# EAGLE board marionette (EAGLE 7.7.0), part 1 of 3
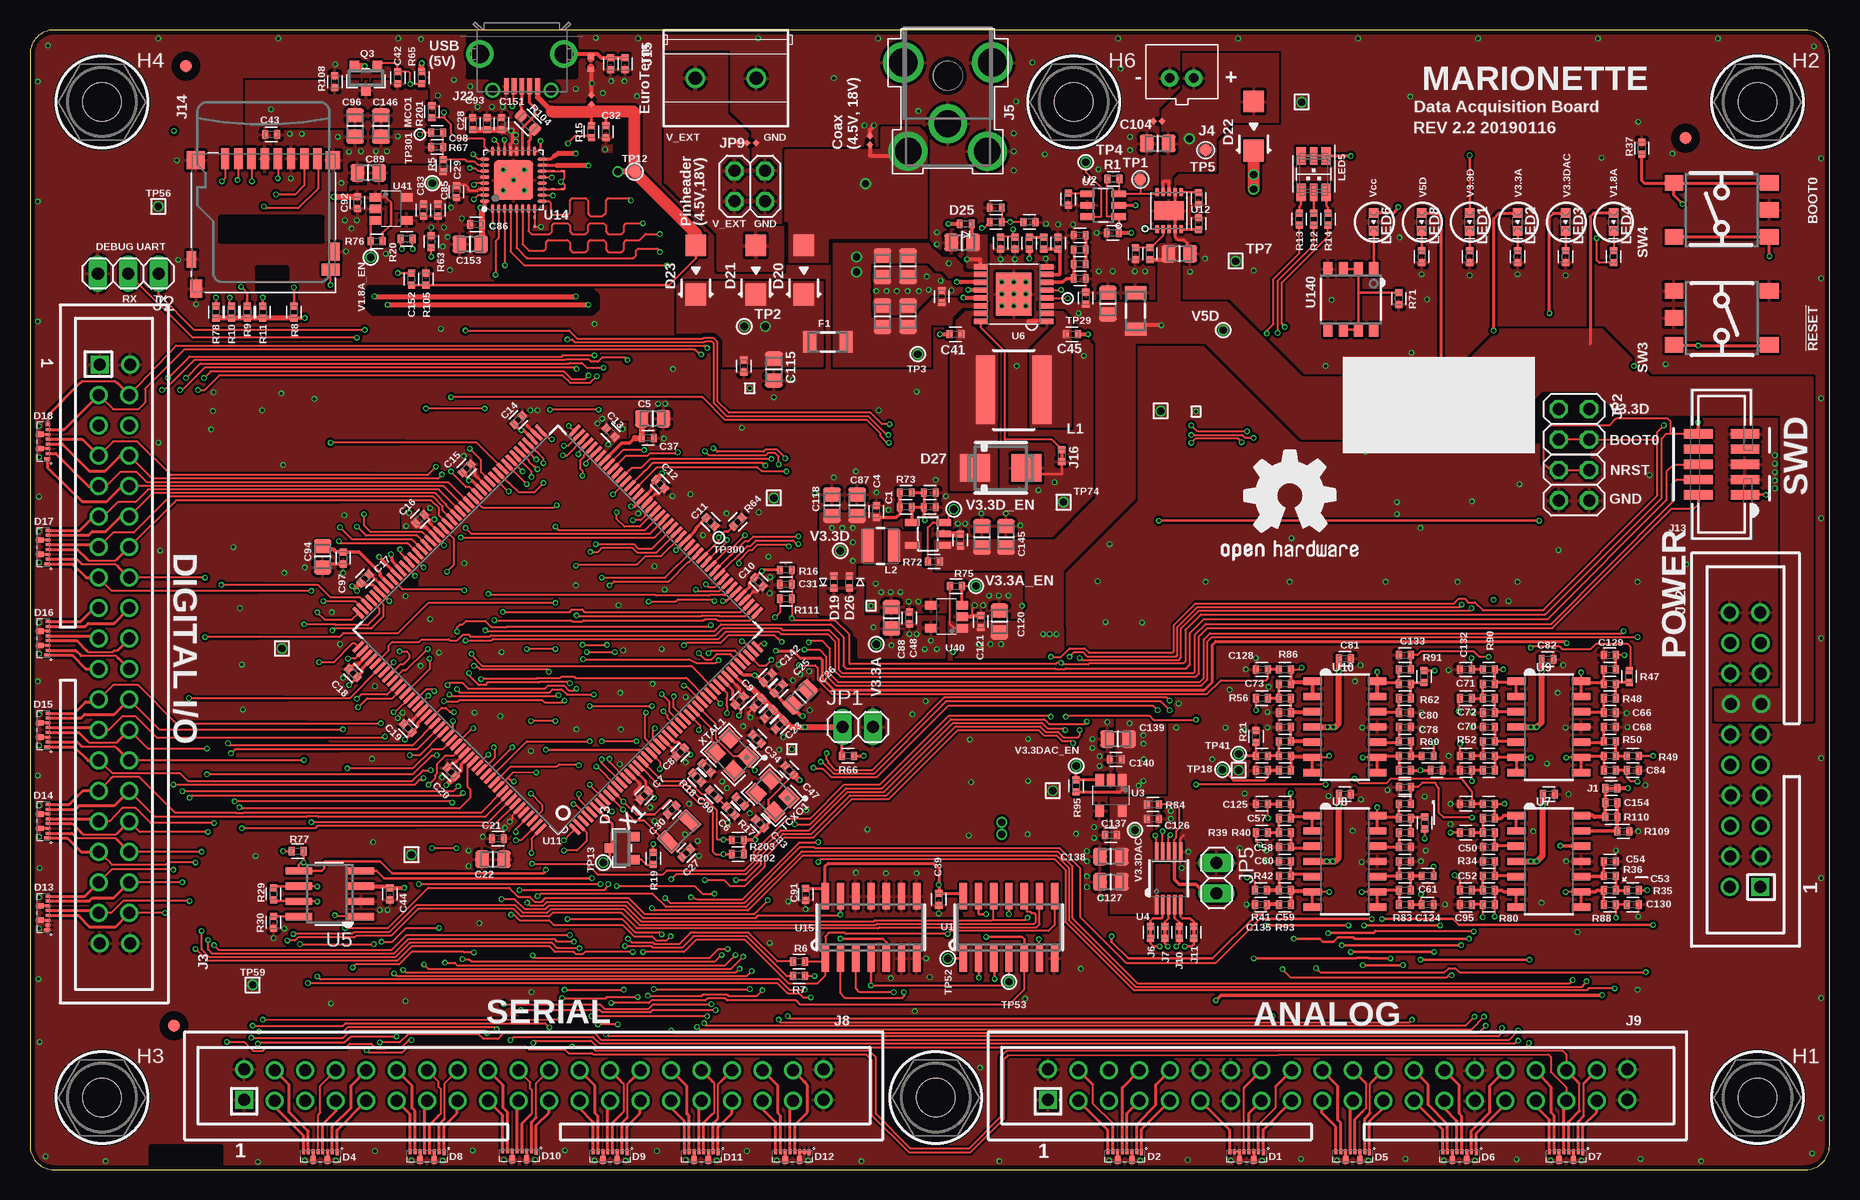
[diagram p11: board, top side]
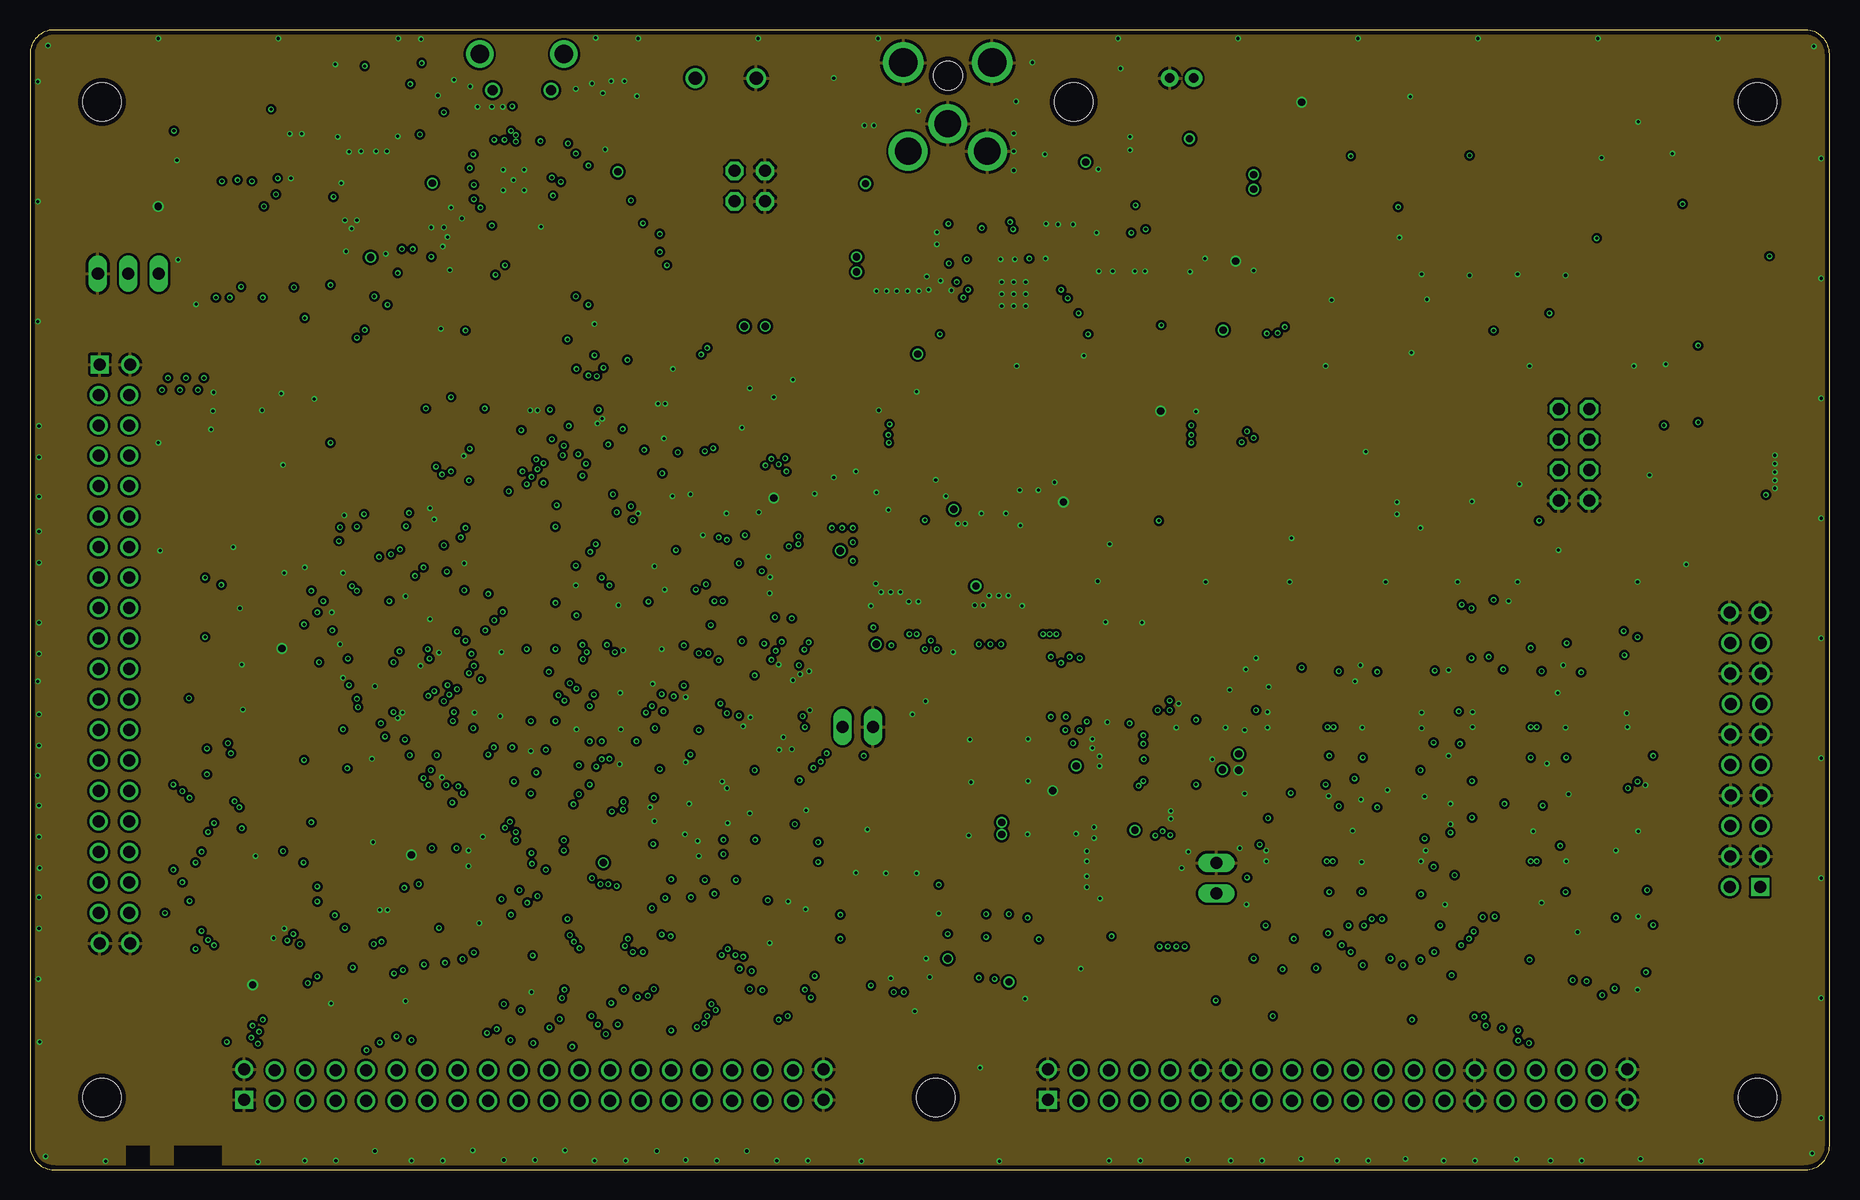
[diagram p12: board, inner layer Route2]
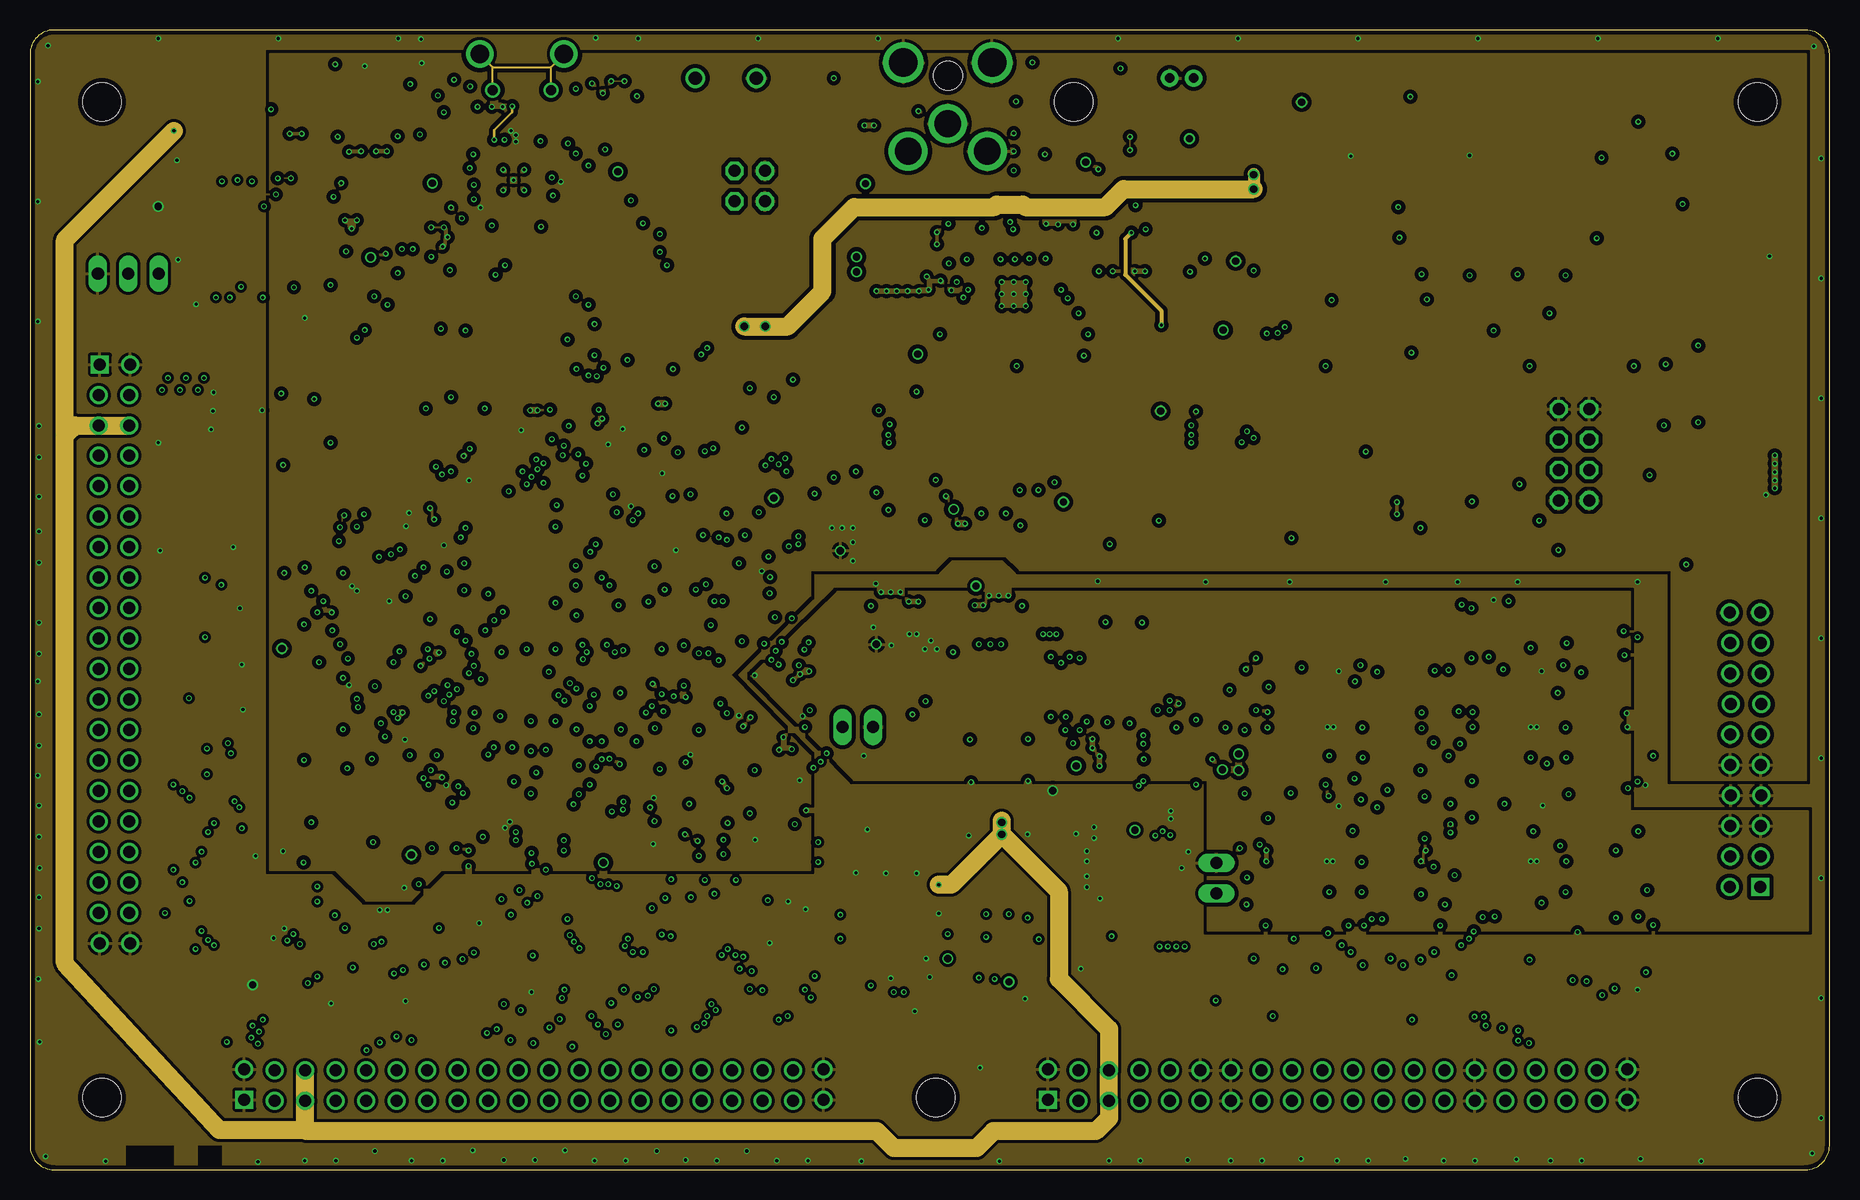
[diagram p13: board, inner layer Route15]
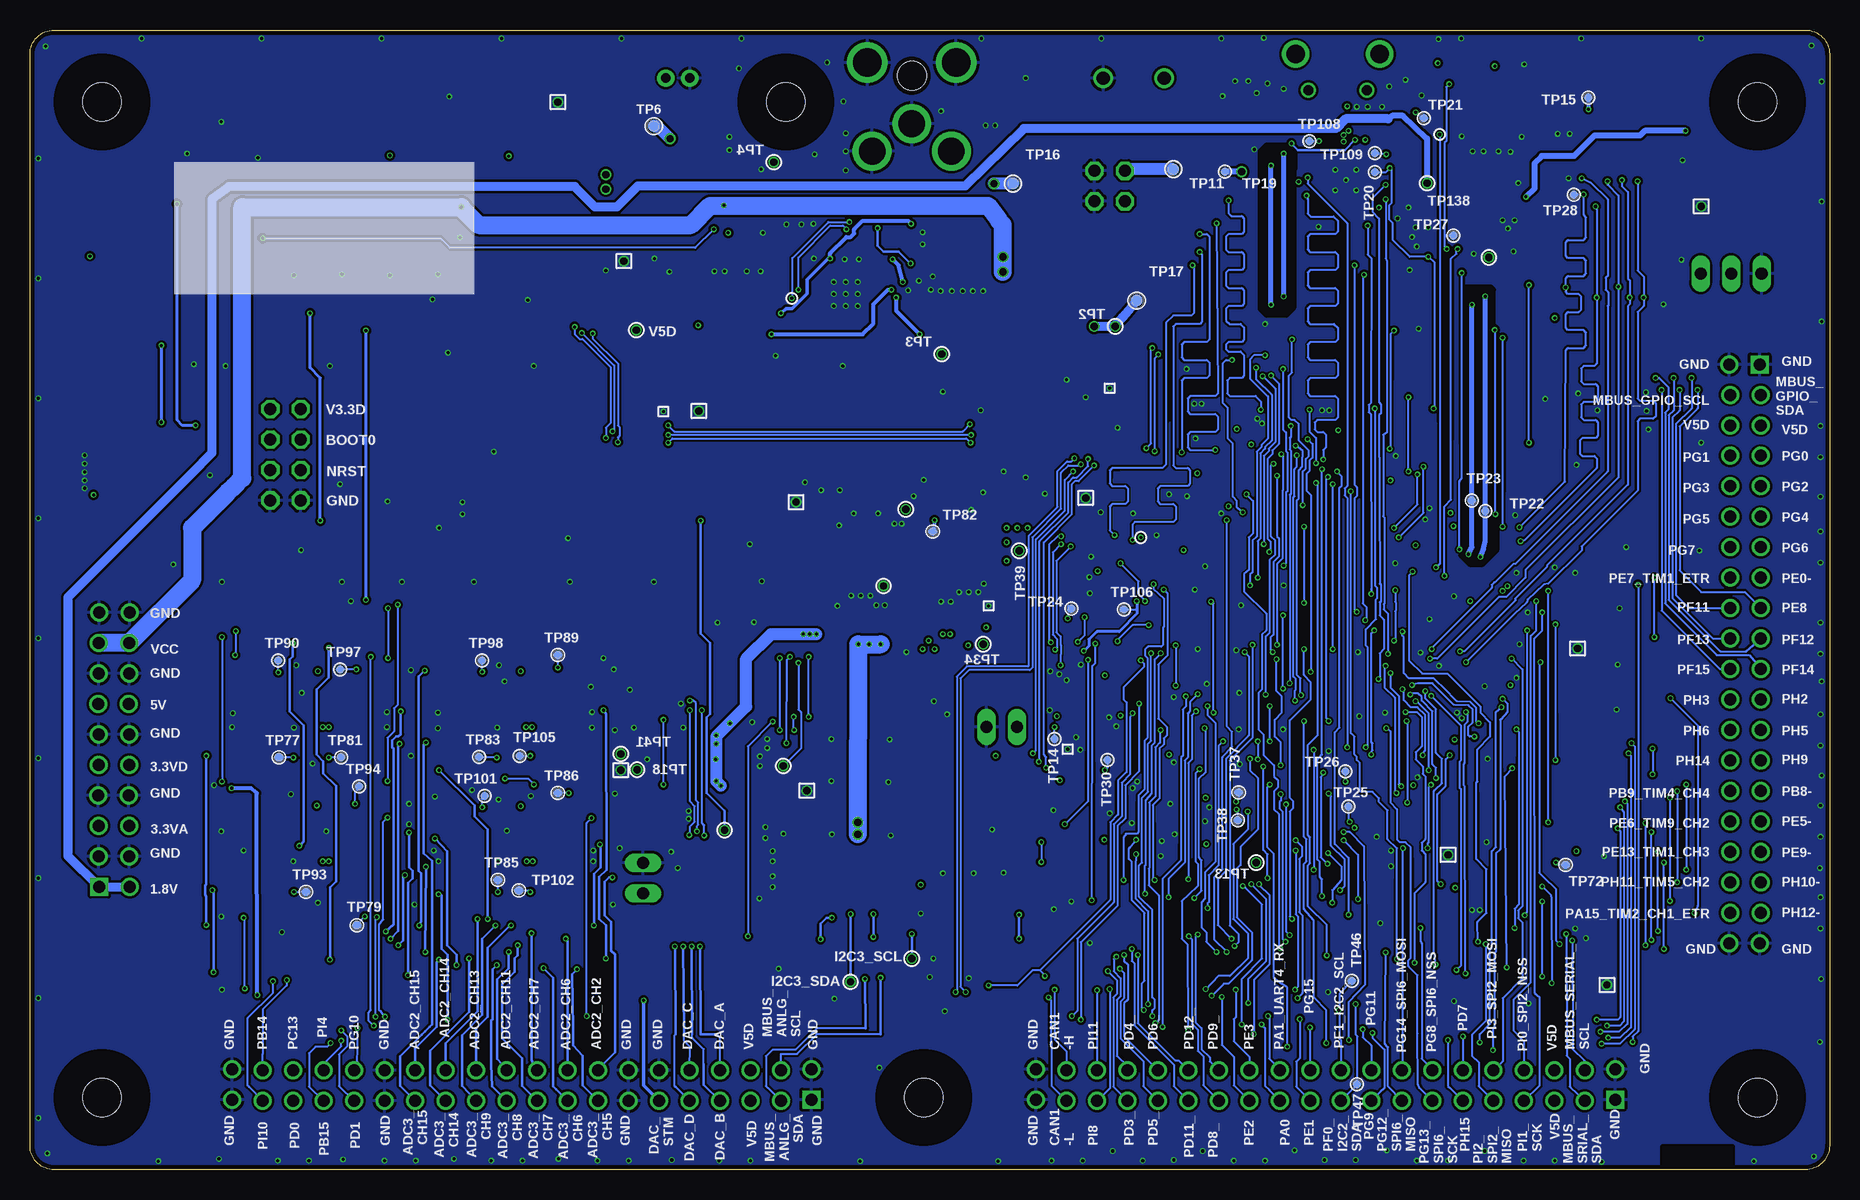
[diagram p14: board, bottom side, seen from below]

Size 150 x 95.01 mm. Coordinates in mm from the lower left corner, seen from the top.
Outline: 148,95 2,95.01 arc90 0,93.01 0,2 arc90 2,0 148,0 arc90 150,2 150,93 arc90 148,95
Copper layers (1*2*15*16): Top 0.035559375mm / dielectric 0.17018125mm / Route2 0.01778125mm / dielectric 47mil / Route15 0.01778125mm / dielectric 0.17018125mm / Bottom 0.035559375mm
Design rules "oshpark-4layer *": minimum track width 5mil, minimum drill 10mil, track to track 0.15mm, track to pad 0.15mm, pad to pad 0.15mm, via to via 0.15mm, smd to smd 0.15mm, copper to edge 15mil, drill to drill 6mil, minimum pad ring 4mil, minimum via ring 4mil, stop-mask expansion 2.5mil, vias tented up to drill 0mil, thermal gap 10mil
Net classes: 0 default: width 0.15 mm, drill 0.25 mm, clearance 0.125 mm; 1 dt_line: width 0.4 mm, drill 0.25 mm, clearance 0.127 mm to class 0, clearance 0.127 mm; 3 med-isolate: width 0.2 mm, drill 0.25 mm, clearance 0.35 mm to class 0, clearance 0.2 mm to class 1, clearance 0.2 mm to class 2, clearance 0.2 mm
tRestrict: 25 lines
bRestrict: 21 lines

## Footprints (pad centres in the part's own frame; a part is rotated, then mirrored left to right if it is on the bottom)
.0402-B = smd 0.6 x 0.7: 1 -0.5,0; 2 0.5,0
.0805-B = smd 1.15 x 1.45: 1 -0.9,0; 2 0.9,0
1206-B = smd 1.15 x 1.8: 1 -1.5,0; 2 1.5,0
UDFN-8-3.3X1.0_6MIL = smd 0.25 x 0.5: 1 -1.4,-0.35 | smd 0.25 x 0.4: 2 -1,-0.4; 3 -0.6,-0.4; 4 -0.2,-0.4; 5 0.2,-0.4; 6 0.6,-0.4; 7 1,-0.4; 8 1.4,-0.4 | smd 0.44 x 0.65: 9 0.595,0.275; 10 -0.595,0.275
SOT23-3 = smd 0.8 x 0.9: 1 -0.95,-1; 2 0.95,-1; 3 0,1
.0402-B-NOSILK-DIODE = smd 0.6 x 0.7: A -0.5,0; C 0.5,0
SMA = smd 1.8 x 1.7: A 2.05,0; K -2.05,0
SMB = smd 2.5 x 2.3: ANODE 2.15,0; CATH -2.15,0
R1206 = smd 1.15 x 1.8: 1 -1.5,0; 2 1.5,0
FIDUCIAL-1.0X2.0 = smd 1 x 1: FIDUCIAL 0,0
#4/.300-BARE+STD_NUT_OR_STAR_WASHER = hole 3.175: 0,0
JUMPER-SHORTED-CUTTABLE-E0402-0.3MM = smd 0.6 x 0.7: 1 -0.5,0; 2 0.5,0
1X03 = drill 1.016 long: 1 -2.54,0; 2 0,0; 3 2.54,0
IDC_RECEPTACLES = drill 1 square: 1 -24.13,-1.17 | drill 1: 2 -24.13,1.37; 3 -21.59,-1.27; 4 -21.59,1.27; 5 -19.05,-1.27; 6 -19.05,1.27; 7 -16.51,-1.27; 8 -16.51,1.27; 9 -13.97,-1.27; 10 -13.97,1.27; 11 -11.43,-1.27; 12 -11.43,1.27; 13 -8.89,-1.27; 14 -8.89,1.27; 15 -6.35,-1.27; 16 -6.35,1.27; 17 -3.81,-1.27; 18 -3.81,1.27; 19 -1.27,-1.27; 20 -1.27,1.27; 21 1.27,-1.27; 22 1.27,1.27; 23 3.81,-1.27; 24 3.81,1.27; 25 6.35,-1.27; 26 6.35,1.27; 27 8.89,-1.27; 28 8.89,1.27; 29 11.43,-1.27; 30 11.43,1.27; 31 13.97,-1.27; 32 13.97,1.27; 33 16.51,-1.27; 34 16.51,1.27; 35 19.05,-1.27; 36 19.05,1.27; 37 21.59,-1.27; 38 21.59,1.27; 39 24.13,-1.17; 40 24.13,1.37
JST-PH-2-THM = drill 0.8 pad 1.422: 1 1,0; 2 -1,0
PJ-047_NO_MILLED_SLOTS = drill 2.225: RING 4,0; SWITCH 6.3,3.3; TIP 6.3,-3.3 | drill 2.375: S1 -1.1,3.7; S2 -1.1,-3.7 | hole 2.4: 0,0
IDC_RECEPTACLES_20PIN = drill 1 square: 1 -11.43,-1.22 | drill 1: 2 -11.43,1.32; 3 -8.89,-1.27; 4 -8.89,1.27; 5 -6.35,-1.27; 6 -6.35,1.27; 7 -3.81,-1.32; 8 -3.81,1.22; 9 -1.27,-1.27; 10 -1.27,1.27; 11 1.27,-1.27; 12 1.27,1.27; 13 3.81,-1.32; 14 3.81,1.22; 15 6.35,-1.27; 16 6.35,1.27; 17 8.89,-1.27; 18 8.89,1.27; 19 11.43,-1.22; 20 11.43,1.32
CONN_HEADER_JTAG_SMD_10PIN_50MIL = smd 0.76 x 2.4: 1 -2.54,-1.95; 2 -2.54,1.95; 3 -1.27,-1.95; 4 -1.27,1.95; 5 0,-1.95; 6 0,1.95; 7 1.27,-1.95; 8 1.27,1.95; 9 2.54,-1.95; 10 2.54,1.95
HIROSE_DM3D(MICRO-SD) = smd 1.5 x 1.5: G1 -7.782,10.035 | smd 1.23 x 1.5: G2 3.65,10.035 | smd 0.8 x 1.5: G3 3.818,2.435 | smd 0.8 x 1.4: G4 -8.132,1.785 | smd 0.7 x 1.75: P1 -5.332,10.16; P2 -4.232,10.16; P3 -3.132,10.16; P4 -2.032,10.16; P5 -0.932,10.16; P6 0.168,10.16; P7 1.268,10.16; P8 2.368,10.16 | smd 1.5 x 1: S0 3.468,0.935 | smd 1 x 1.5: S1 -7.732,-0.64
CONN-TERM-EUROSTYLE_200MIL_2X1 = drill 1.1: 1 -2.54,0; 2 2.54,0
JUMPER-SHORTED-CUTTABLE-E0402-0.3MM-NOSILK = smd 0.6 x 0.7: 1 -0.5,0; 2 0.5,0
ZX62D-B-5P8 = smd 0.4 x 1.35: P1 -1.3,2.675; P2 -0.65,2.675; P3 0,2.675; P4 0.65,2.675; P5 1.3,2.675 | drill 1.524: P$1 3.51,0; P$2 -3.51,0 | drill 0.838: P$3 -2.425,3; P$4 2.425,3
1X02 = drill 1.016 long: 1 -1.27,0; 2 1.27,0
2X04 = drill 1.016 octagon: 1 -3.81,-1.27; 2 -3.81,1.27; 3 -1.27,-1.27; 4 -1.27,1.27; 5 1.27,-1.27; 6 1.27,1.27; 7 3.81,-1.27; 8 3.81,1.27
2X02 = drill 1.016 octagon: 1 -1.27,-1.27; 2 -1.27,1.27; 3 1.27,-1.27; 4 1.27,1.27
L_SHIELDED_6.3MM_6.3MM_4.5MM = smd 1.6 x 5.7: 1 -2.35,0; 2 2.35,0
INDUCTOR_3MM_3MM_1.5MM = smd 2.7 x 1: 1 0,1.1; 2 0,-1.1
CHIPLED_0603 = smd 0.8 x 0.8: A 0,-0.75; C 0,0.75
LED-3528 = smd 1.45 x 0.8: 1 -1.525,1.05; 3 -1.525,-1.05; 4 1.525,-1.05; 6 1.525,1.05 | smd 1.45 x 0.6: 2 -1.525,0; 5 1.525,0
.0603-B = smd 0.8 x 0.95: 1 -0.8,0; 2 0.8,0
TRACE_BRIDGE_6MIL = smd 0.15 x 0.25: 1 0,0.4; 2 0,-0.4
SPARKGAP_0.15MM = smd 0.4 x 0.4 rotated 45: 1 0,0.362; 2 0,-0.362
SPARKGAP_5MIL = smd 0.508 x 0.381: 1 0,0.531; 2 0,-0.531
SWITCH_TAC_NO_GNDED = smd 1.55 x 1.3: 1 -3.975,2.25; 2 3.975,2.25; 3 -3.975,-2.25; 4 3.975,-2.25; 5 3.975,0
CRYSTAL-3.2X2.5(4_TERMINAL) = smd 1.4 x 1.2: 1 -1.1,-0.85; 2 1.1,-0.85; 3 1.1,0.85; 4 -1.1,0.85
PAD-ROUND-1.0-NOCREAM+SILK = smd 1 x 1: PAD 0,0
PAD+VIA_0.6MM = drill 0.6: TP 0,0
PAD+GND_VIA_0.6MM = drill 0.6: TP 0,0
PAD-ROUND-0.7-NOCREAM+SILK = smd 0.7 x 0.7: PAD 0,0
PAD+VIA_0.25MM = drill 0.254: TP 0,0
PAD+GND_VIA_0.25MM = drill 0.254: TP 0,0
SO14 = smd 0.6 x 2.2: 1 -3.81,-2.6; 2 -2.54,-2.6; 3 -1.27,-2.6; 4 0,-2.6; 5 1.27,-2.6; 6 2.54,-2.6; 7 3.81,-2.6; 8 3.81,2.6; 9 2.54,2.6; 10 1.27,2.6; 11 0,2.6; 12 -1.27,2.6; 13 -2.54,2.6; 14 -3.81,2.6
SOT23-6 = smd 0.55 x 1.2: 1 -0.95,-1.3; 2 0,-1.3; 3 0.95,-1.3; 4 0.95,1.3; 5 0,1.3; 6 -0.95,1.3
SOT23-5 = smd 0.7 x 1: 1 0.95,1.3; 2 0,1.3; 3 -0.95,1.3; 4 -0.95,-1.3; 5 0.95,-1.3
10-TFSOP = smd 0.3 x 1.6: 1 -1,-2.2; 2 -0.5,-2.2; 3 0,-2.2; 4 0.5,-2.2; 5 1,-2.2; 6 1,2.2; 7 0.5,2.2; 8 0,2.2; 9 -0.5,2.2; 10 -1,2.2
SO8 = smd 0.6 x 2.2: 1 -1.905,-2.6; 2 -0.635,-2.6; 3 0.635,-2.6; 4 1.905,-2.6; 5 1.905,2.6; 6 0.635,2.6; 7 -0.635,2.6; 8 -1.905,2.6
16-LEAD-PLASTIC-TSSOP-FE = smd 0.45 x 1.05: 1 -2.275,-2.775; 2 -1.625,-2.775; 3 -0.975,-2.775; 4 -0.325,-2.775; 5 0.325,-2.775; 6 0.975,-2.775; 7 1.625,-2.775; 8 2.275,-2.775; 9 2.275,2.775; 10 1.625,2.775; 11 0.975,2.775; 12 0.325,2.775; 13 -0.325,2.775; 14 -0.975,2.775; 15 -1.625,2.775; 16 -2.275,2.775 | smd 3.58 x 2.94: PAD 0,0
SOIC-14 = smd 0.6 x 1.55: 1 -3.81,-2.7; 2 -2.54,-2.7; 3 -1.27,-2.7; 4 0,-2.7; 5 1.27,-2.7; 6 2.54,-2.7; 7 3.81,-2.7; 8 3.81,2.7; 9 2.54,2.7; 10 1.27,2.7; 11 0,2.7; 12 -1.27,2.7; 13 -2.54,2.7; 14 -3.81,2.7
LQFP176 = smd 1.2 x 0.3: 1 -12.75,10.75; 2 -12.75,10.25; 3 -12.75,9.75; 4 -12.75,9.25; 5 -12.75,8.75; 6 -12.75,8.25; 7 -12.75,7.75; 8 -12.75,7.25; 9 -12.75,6.75; 10 -12.75,6.25; 11 -12.75,5.75; 12 -12.75,5.25; 13 -12.75,4.75; 14 -12.75,4.25; 15 -12.75,3.75; 16 -12.75,3.25; 17 -12.75,2.75; 18 -12.75,2.25; 19 -12.75,1.75; 20 -12.75,1.25; 21 -12.75,0.75; 22 -12.75,0.25; 23 -12.75,-0.25; 24 -12.75,-0.75; 25 -12.75,-1.25; 26 -12.75,-1.75; 27 -12.75,-2.25; 28 -12.75,-2.75; 29 -12.75,-3.25; 30 -12.75,-3.75; 31 -12.75,-4.25; 32 -12.75,-4.75; 33 -12.75,-5.25; 34 -12.75,-5.75; 35 -12.75,-6.25; 36 -12.75,-6.75; 37 -12.75,-7.25; 38 -12.75,-7.75; 39 -12.75,-8.25; 40 -12.75,-8.75; 41 -12.75,-9.25; 42 -12.75,-9.75; 43 -12.75,-10.25; 44 -12.75,-10.75; 89 12.75,-10.75; 90 12.75,-10.25; 91 12.75,-9.75; 92 12.75,-9.25; 93 12.75,-8.75; 94 12.75,-8.25; 95 12.75,-7.75; 96 12.75,-7.25; 97 12.75,-6.75; 98 12.75,-6.25; 99 12.75,-5.75; 100 12.75,-5.25; 101 12.75,-4.75; 102 12.75,-4.25; 103 12.75,-3.75; 104 12.75,-3.25; 105 12.75,-2.75; 106 12.75,-2.25; 107 12.75,-1.75; 108 12.75,-1.25; 109 12.75,-0.75; 110 12.75,-0.25; 111 12.75,0.25; 112 12.75,0.75; 113 12.75,1.25; 114 12.75,1.75; 115 12.75,2.25; 116 12.75,2.75; 117 12.75,3.25; 118 12.75,3.75; 119 12.75,4.25; 120 12.75,4.75; 121 12.75,5.25; 122 12.75,5.75; 123 12.75,6.25; 124 12.75,6.75; 125 12.75,7.25; 126 12.75,7.75; 127 12.75,8.25; 128 12.75,8.75; 129 12.75,9.25; 130 12.75,9.75; 131 12.75,10.25; 132 12.75,10.75 | smd 0.3 x 1.2: 45 -10.75,-12.75; 46 -10.25,-12.75; 47 -9.75,-12.75; 48 -9.25,-12.75; 49 -8.75,-12.75; 50 -8.25,-12.75; 51 -7.75,-12.75; 52 -7.25,-12.75; 53 -6.75,-12.75; 54 -6.25,-12.75; 55 -5.75,-12.75; 56 -5.25,-12.75; 57 -4.75,-12.75; 58 -4.25,-12.75; 59 -3.75,-12.75; 60 -3.25,-12.75; 61 -2.75,-12.75; 62 -2.25,-12.75; 63 -1.75,-12.75; 64 -1.25,-12.75; 65 -0.75,-12.75; 66 -0.25,-12.75; 67 0.25,-12.75; 68 0.75,-12.75; 69 1.25,-12.75; 70 1.75,-12.75; 71 2.25,-12.75; 72 2.75,-12.75; 73 3.25,-12.75; 74 3.75,-12.75; 75 4.25,-12.75; 76 4.75,-12.75; 77 5.25,-12.75; 78 5.75,-12.75; 79 6.25,-12.75; 80 6.75,-12.75; 81 7.25,-12.75; 82 7.75,-12.75; 83 8.25,-12.75; 84 8.75,-12.75; 85 9.25,-12.75; 86 9.75,-12.75; 87 10.25,-12.75; 88 10.75,-12.75; 133 10.75,12.75; 134 10.25,12.75; 135 9.75,12.75; 136 9.25,12.75; 137 8.75,12.75; 138 8.25,12.75; 139 7.75,12.75; 140 7.25,12.75; 141 6.75,12.75; 142 6.25,12.75; 143 5.75,12.75; 144 5.25,12.75; 145 4.75,12.75; 146 4.25,12.75; 147 3.75,12.75; 148 3.25,12.75; 149 2.75,12.75; 150 2.25,12.75; 151 1.75,12.75; 152 1.25,12.75; 153 0.75,12.75; 154 0.25,12.75; 155 -0.25,12.75; 156 -0.75,12.75; 157 -1.25,12.75; 158 -1.75,12.75; 159 -2.25,12.75; 160 -2.75,12.75; 161 -3.25,12.75; 162 -3.75,12.75; 163 -4.25,12.75; 164 -4.75,12.75; 165 -5.25,12.75; 166 -5.75,12.75; 167 -6.25,12.75; 168 -6.75,12.75; 169 -7.25,12.75; 170 -7.75,12.75; 171 -8.25,12.75; 172 -8.75,12.75; 173 -9.25,12.75; 174 -9.75,12.75; 175 -10.25,12.75; 176 -10.75,12.75
10-LEAD-DFN = smd 0.3 x 0.65: 1 -1,-1.55; 2 -0.5,-1.55; 3 0,-1.55; 4 0.5,-1.55; 5 1,-1.55; 6 1,1.55; 7 0.5,1.55; 8 0,1.55; 9 -0.5,1.55; 10 -1,1.55 | smd 2.48 x 1.55: EP 0,0
QFN32-5X5 = smd 0.78 x 0.28: 1 -2.4,1.75; 2 -2.4,1.25; 3 -2.4,0.75; 4 -2.4,0.25; 5 -2.4,-0.25; 6 -2.4,-0.75; 7 -2.4,-1.25; 8 -2.4,-1.75; 17 2.4,-1.75; 18 2.4,-1.25; 19 2.4,-0.75; 20 2.4,-0.25; 21 2.4,0.25; 22 2.4,0.75; 23 2.4,1.25; 24 2.4,1.75 | smd 0.28 x 0.78: 9 -1.75,-2.4; 10 -1.25,-2.4; 11 -0.75,-2.4; 12 -0.25,-2.4; 13 0.25,-2.4; 14 0.75,-2.4; 15 1.25,-2.4; 16 1.75,-2.4; 25 1.75,2.4; 26 1.25,2.4; 27 0.75,2.4; 28 0.25,2.4; 29 -0.25,2.4; 30 -0.75,2.4; 31 -1.25,2.4; 32 -1.75,2.4 | smd 3.3 x 3.3: PAD 0,0
SOT23-5L = smd 0.55 x 1.2: 1 -0.95,-1.3; 2 0,-1.3; 3 0.95,-1.3; 4 0.95,1.3; 5 -0.95,1.3
SOIC-8 = smd 0.762 x 1.143: 1 -1.905,-2.54; 2 -0.635,-2.54; 3 0.635,-2.54; 4 1.905,-2.54; 5 1.905,2.54; 6 0.635,2.54; 7 -0.635,2.54; 8 -1.905,2.54
2-SMD_ABM7 = smd 1 x 1.8: P$1 -1.25,0; P$2 1.25,0

## Placement (x,y rotation side)
C1  6.8p  [.0402-B]  73,55.25 180 top
C2  100n  [.0402-B]  77.55,52.5 270 top
C3  33p  [.0402-B]  75,55.25 180 top
C4  100n  [.0402-B]  70.55,54.85 270 top
C5  4.7u  [.0805-B]  51.9,62.6 0 top
C6  10p  [.0402-B]  58.4,29.9 135 top
C7  100n  [.0402-B]  51.2,31.2 225 top
C8  100n  [.0402-B]  54.2,34.8 225 top
C9  100n  [.0402-B]  59.15,39.1 45 top
C10  100n  [.0402-B]  60.75,49 315 top
C11  100n  [.0402-B]  56.73,54 315 top
C12  100n  [.0402-B]  52.52,57.15 315 top
C13  100n  [.0402-B]  48.4,61.45 135 top
C14  100n  [.0402-B]  40.7,62.5 45 top
C15  100n  [.0402-B]  36.4,58.48 45 top
C16  100n  [.0402-B]  32.5,54.25 45 top
C17  100n  [.0402-B]  27.93,49.27 45 top
C18  100n  [.0402-B]  26.93,41.4 135 top
C19  100n  [.0402-B]  31.5,36.8 135 top
C20  100n  [.0402-B]  35.12,33.15 135 top
C21  100n  [.0402-B]  39,27.6 180 top
C22  4.7u  [.0805-B]  38.6,25.88 180 top
C23  1u  [.0402-B]  62.5,37.1 225 top
C24  100n  [.0402-B]  61.6,38 225 top
C25  100n  [.0402-B]  62.4,40.1 45 top
C26  4.7u  [.0805-B]  64.2,39.4 45 top
C27  10p  [.0402-B]  54.7,26.4 45 top
C28  1u  [.0402-B]  36.9,87.2 90 top
C29  10n  [.0402-B]  35.55,81.55 270 top
C30  10p  [.0402-B]  53.5,30 45 top
C31  100n  [.0402-B]  63,48.8 180 top
C32  1u  [.0402-B]  48,86.55 270 top
C33  10n  [.0402-B]  60.85,28.85 135 top
C34  DNP  [.0402-B]  60.6,35.9 135 top
C35  DNP  [.0402-B]  56.4,33.5 315 top
C36  100n  [.0402-B]  49.6,92.2 270 top
C37  100n  [.0402-B]  51.5,61 0 top
C38  4.7u  [.0805-B]  79.35,52.75 90 top
C39  100n  [.0402-B]  75.75,22.55 270 top
C40  100n  [.0402-B]  59.5,67 270 top
C41  68n  [.0402-B]  77.15,69.65 0 top
C42  100p  [.0402-B]  30.65,91.05 90 top
C43  100n  [.0402-B]  20.1,86.3 0 top
C44  100n  [.0402-B]  30,23 90 top
C45  68n  [.0402-B]  86.85,69.65 180 top
C46  4.7u  [.0805-B]  71.05,75.3 270 top
C47  100n  [.0402-B]  63.3,33.3 135 top
C48  100n  [.0402-B]  73.3,46 270 top
C49  1n  [.0402-B]  121.6,29.3 180 top
C50  1n  [.0402-B]  121.6,26.9 180 top
C51  1n  [.0402-B]  121.6,23.3 180 top
C52  1n  [.0402-B]  121.6,25.7 180 top
C53  1n  [.0402-B]  131.7,23.3 0 top
C54  1n  [.0402-B]  131.7,25.7 0 top
C55  1u  [.0402-B]  109.6,31.3 0 top
C56  1u  [.0402-B]  126.6,31.3 0 top
C57  1n  [.0402-B]  104.6,29.3 180 top
C58  1n  [.0402-B]  104.6,26.9 180 top
C59  1n  [.0402-B]  104.6,23.3 180 top
C60  1n  [.0402-B]  104.6,25.7 180 top
C61  1n  [.0402-B]  114.6,23.3 0 top
C62  1n  [.0402-B]  114.6,25.7 0 top
C63  1n  [.0402-B]  114.6,29.3 0 top
C64  1n  [.0402-B]  114.6,26.9 0 top
C65  1n  [.0402-B]  131.7,40.5 0 top
C66  1n  [.0402-B]  131.7,38.1 0 top
C67  1n  [.0402-B]  131.7,34.5 0 top
C68  1n  [.0402-B]  131.7,36.9 0 top
C69  1n  [.0402-B]  121.6,34.5 180 top
C70  1n  [.0402-B]  121.6,36.9 180 top
C71  1n  [.0402-B]  121.6,40.5 180 top
C72  1n  [.0402-B]  121.6,38.1 180 top
C73  1n  [.0402-B]  104.6,40.5 180 top
C74  1n  [.0402-B]  104.6,38.1 180 top
C75  1n  [.0402-B]  104.6,34.5 180 top
C76  1n  [.0402-B]  104.6,36.9 180 top
C77  1n  [.0402-B]  114.6,34.5 0 top
C78  1n  [.0402-B]  114.6,36.9 0 top
C79  1n  [.0402-B]  114.6,40.5 0 top
C80  1n  [.0402-B]  114.6,38.1 0 top
C81  1u  [.0402-B]  109.6,42.6 0 top
C82  1u  [.0402-B]  126.5,42.55 0 top
C83  1u  [.0402-B]  32.8,80 270 top
C84  DNP  [.0402-B]  133.6,33.3 0 top
C85  1u  [.0402-B]  34,80 270 top
C86  100n  [.0402-B]  37.2,78.8 180 top
C87  4.7u  [.0805-B]  68.95,55.4 90 top
C88  4.7u  [.0805-B]  71.8,46 90 top
C89  4.7u  [.0805-B]  28.2,83.1 180 top
C90  100n  [.0402-B]  57,31.3 315 top
C91  100n  [.0402-B]  64.65,22.95 270 top
C92  100n  [.0402-B]  27.3,80.6 90 top
C93  1u  [.0402-B]  38.1,87.2 90 top
C94  4.7u  [.0805-B]  24.4,51.1 270 top
C95  DNP  [.0402-B]  119.7,22.1 180 top
C96  4.7u  [.0805-B]  27.1,87 270 top
C97  100n  [.0402-B]  26.1,51 270 top
C98  100n  [.0402-B]  33.95,86.45 0 top
C99  100n  [.0402-B]  82.1,77.25 90 top
C100  4.7u  [.0805-B]  89.85,72.2 90 top
C101  10n  [.0402-B]  87.5,75.5 180 top
C102  100n  [.0402-B]  76,72.8 270 top
C103  100n  [.0402-B]  86.55,80.9 270 top
C104  4.7u  [.0805-B]  94,85.55 180 top
C105  4.7u  [.0805-B]  95.8,76.35 0 top
C106  DNP  [1206-B]  92.15,71.6 90 top
C107  4.7u  [.0805-B]  71.05,71.15 90 top
C108  4.7u  [.0805-B]  73.2,71.15 90 top
C109  100n  [.0402-B]  90.25,78.1 180 top
C110  100n  [.0402-B]  97.4,80.95 270 top
C111  100n  [.0402-B]  88,72.65 270 top
C112  4.7u  [.0805-B]  77.7,77.3 180 top
C113  100n  [.0402-B]  83.3,79 180 top
C114  10p  [.0402-B]  87.5,74.3 180 top
C115  4.7u  [.0805-B]  62,66.7 270 top
C116  4.7u  [.0805-B]  73.2,75.3 270 top
C117  10n  [.0402-B]  87.5,76.7 180 top
C118  4.7u  [.0805-B]  66.85,55.4 90 top
C120  4.7u  [.0805-B]  80.8,45.7 90 top
C121  100n  [.0402-B]  79.25,45.7 270 top
C122  DNP  [.0402-B]  119.7,33.3 180 top
C123  DNP  [.0402-B]  117.25,33.3 0 top
C124  DNP  [.0402-B]  116.5,22.1 0 top
C125  DNP  [.0402-B]  102.7,30.5 180 top
C126  100n  [.0402-B]  93.6,29.25 0 top
C127  4.7u  [.0805-B]  90.1,24 180 top
C128  DNP  [.0402-B]  102.7,41.7 180 top
C129  DNP  [.0402-B]  131.7,42.9 180 top
C130  DNP  [.0402-B]  133.6,22.1 0 top
C131  DNP  [.0402-B]  119.7,30.5 180 top
C132  DNP  [.0402-B]  119.7,41.7 180 top
C133  DNP  [.0402-B]  114.6,42.9 180 top
C134  DNP  [.0402-B]  114.6,31.9 180 top
C135  DNP  [.0402-B]  102.6,22.1 180 top
C136  DNP  [.0402-B]  102.7,33.3 180 top
C137  100n  [.0402-B]  90.1,27.9 0 top
C138  4.7u  [.0805-B]  90.1,26.1 180 top
C139  4.7u  [.0805-B]  90.7,35.9 180 top
C140  100n  [.0402-B]  90.5,34.2 0 top
C142  10n  [.0402-B]  61.5,41 45 top
C143  10n  [.0402-B]  60.7,38.9 225 top
C145  4.7u  [.0805-B]  81.35,52.75 90 top
C146  4.7u  [.0805-B]  29.25,87 270 top
C151  100n  [.0402-B]  39.3,87.2 90 top
C152  100n  [.0402-B]  33,74.25 90 top
C153  4.7u  [.0805-B]  36.7,77.15 180 top
C154  10p  [.0402-B]  131.8,30.6 0 top
D1  ESD8006-ESD8006  [UDFN-8-3.3X1.0_6MIL]  101.4,1.1 180 top
D2  ESD8006-ESD8006  [UDFN-8-3.3X1.0_6MIL]  91.25,1.1 180 top
D3  BAS40-00  [SOT23-3]  49.35,26.8 90 top
D4  ESD8006-ESD8006  [UDFN-8-3.3X1.0_6MIL]  24.2,1.1 180 top
D5  ESD8006-ESD8006  [UDFN-8-3.3X1.0_6MIL]  110.25,1.1 180 top
D6  ESD8006-ESD8006  [UDFN-8-3.3X1.0_6MIL]  119.15,1.1 180 top
D7  ESD8006-ESD8006  [UDFN-8-3.3X1.0_6MIL]  128.05,1.1 180 top
D8  ESD8006-ESD8006  [UDFN-8-3.3X1.0_6MIL]  33.1,1.1 180 top
D9  ESD8006-ESD8006  [UDFN-8-3.3X1.0_6MIL]  48.35,1.1 180 top
D10  ESD8006-ESD8006  [UDFN-8-3.3X1.0_6MIL]  40.8,1.15 180 top
D11  ESD8006-ESD8006  [UDFN-8-3.3X1.0_6MIL]  55.95,1.1 180 top
D12  ESD8006-ESD8006  [UDFN-8-3.3X1.0_6MIL]  63.55,1.1 180 top
D13  ESD8006-ESD8006  [UDFN-8-3.3X1.0_6MIL]  1.1,21.4 90 top
D14  ESD8006-ESD8006  [UDFN-8-3.3X1.0_6MIL]  1.1,29.05 90 top
D15  ESD8006-ESD8006  [UDFN-8-3.3X1.0_6MIL]  1.1,36.65 90 top
D16  ESD8006-ESD8006  [UDFN-8-3.3X1.0_6MIL]  1.1,44.3 90 top
D17  ESD8006-ESD8006  [UDFN-8-3.3X1.0_6MIL]  1.1,51.9 90 top
D18  ESD8006-ESD8006  [UDFN-8-3.3X1.0_6MIL]  1.1,60.7 90 top
D19  VSKY05201006-G4-08  [.0402-B-NOSILK-DIODE]  67,49 270 top
D20  CDBA140SL-HF  [SMA]  64.5,75 90 top
D21  CDBA140SL-HF  [SMA]  60.5,75 90 top
D22  CDBA140SL-HF  [SMA]  102,87 90 top
D23  CDBA140SL-HF  [SMA]  55.5,75 90 top
D25  VSKY05201006-G4-08  [.0402-B-NOSILK-DIODE]  78,78.85 0 top
D26  VSKY05201006-G4-08  [.0402-B-NOSILK-DIODE]  68.3,49 90 top
D27  NP  [SMB]  80.9,58.5 0 top
F1  2A  [R1206]  66.5,69 0 top
FIDUCIAL2  FIDUCIAL-1.0X2.0  [FIDUCIAL-1.0X2.0]  138,86 0 top
FIDUCIAL3  FIDUCIAL-1.0X2.0  [FIDUCIAL-1.0X2.0]  13,92 0 top
FIDUCIAL6  FIDUCIAL-1.0X2.0  [FIDUCIAL-1.0X2.0]  12,12 0 top
H1  #4-BARE_MOUNTING_HOLE/.300  [#4/.300-BARE+STD_NUT_OR_STAR_WASHER]  144,6 0 top
H2  #4-BARE_MOUNTING_HOLE/.300  [#4/.300-BARE+STD_NUT_OR_STAR_WASHER]  144,89 0 top
H3  #4-BARE_MOUNTING_HOLE/.300  [#4/.300-BARE+STD_NUT_OR_STAR_WASHER]  6,6 0 top
H4  #4-BARE_MOUNTING_HOLE/.300  [#4/.300-BARE+STD_NUT_OR_STAR_WASHER]  6,89 0 top
H5  #4-BARE_MOUNTING_HOLE/.300  [#4/.300-BARE+STD_NUT_OR_STAR_WASHER]  75.5,6 0 top
H6  #4-BARE_MOUNTING_HOLE/.300  [#4/.300-BARE+STD_NUT_OR_STAR_WASHER]  87,89 0 top
J1  [JUMPER-SHORTED-CUTTABLE-E0402-0.3MM]  131.8,31.8 0 top
J2  PINHD-1X3  [1X03]  8.2,74.7 180 top
J3  IDC_RECEPTACLE_2X20-S9175-ND  [IDC_RECEPTACLES]  7,43 270 top
J4  B2B-PH-K-S(LF)(SN)  [JST-PH-2-THM]  96,91 0 top
J5  CON_COAX_PWR_PJ-047AH-NO_MILL  [PJ-047_NO_MILLED_SLOTS]  76.5,91.2 270 top
J6  [JUMPER-SHORTED-CUTTABLE-E0402-0.3MM]  93.4,19.8 270 top
J7  [JUMPER-SHORTED-CUTTABLE-E0402-0.3MM]  94.6,19.8 90 top
J8  IDC_RECEPTACLE_2X20-S9175-ND  [IDC_RECEPTACLES]  42,7 0 top
J9  IDC_RECEPTACLE_2X20-S9175-ND  [IDC_RECEPTACLES]  109,7 0 top
J10  [JUMPER-SHORTED-CUTTABLE-E0402-0.3MM]  95.8,19.8 90 top
J11  [JUMPER-SHORTED-CUTTABLE-E0402-0.3MM]  97,19.8 90 top
J12  IDC_RECEPTACLE_20PIN-S9172-ND  [IDC_RECEPTACLES_20PIN]  143,35 90 top
J13  CONN_HEADER_JTAG  [CONN_HEADER_JTAG_SMD_10PIN_50MIL]  141,58.8 90 top
J14  CON_HIROSE_DM3D(MICROSD)  [HIROSE_DM3D(MICRO-SD)]  21.6,74.1 0 top
J15  0398800302  [CONN-TERM-EUROSTYLE_200MIL_2X1]  58,91 180 top
J16  [JUMPER-SHORTED-CUTTABLE-E0402-0.3MM-NOSILK]  86,59.55 90 top
J17  SCOPE_CLIP_5MM_10MM  [SCOPE_CLIP_5MM_10MM]  115,95 270 bottom
J18  SCOPE_CLIP_5MM_10MM  [SCOPE_CLIP_5MM_10MM]  115,85 90 top
J19  SCOPE_CLIP_5MM_10MM  [SCOPE_CLIP_5MM_10MM]  0,79 0 top
J20  SCOPE_CLIP_5MM_10MM  [SCOPE_CLIP_5MM_10MM]  10,79 0 bottom
J22  ZX62D-B-5P8  [ZX62D-B-5P8]  41,93 180 top
J24  SCOPE_CLIP_5MM_10MM  [SCOPE_CLIP_5MM_10MM]  140,11 0 top
J25  SCOPE_CLIP_5MM_10MM  [SCOPE_CLIP_5MM_10MM]  150,11 0 bottom
JP1  DNP  [1X02]  69,36.9 0 top
JP2  PINHD-2X4  [2X04]  128.7,59.6 270 top
JP5  DNP  [1X02]  98.9,24.3 270 top
JP9  [2X02]  60,82 0 top
L1  6.8u  [L_SHIELDED_6.3MM_6.3MM_4.5MM]  82,65 0 top
L2  SRN3015-2R2M  [INDUCTOR_3MM_3MM_1.5MM]  70.9,52 90 top
LED1  150060VS75000  [CHIPLED_0603]  120,79 180 top
LED2  150060VS75000  [CHIPLED_0603]  124,79 180 top
LED3  150060VS75000  [CHIPLED_0603]  128,79 180 top
LED4  150060VS75000  [CHIPLED_0603]  132,79 180 top
LED5  SMLV56RGB1W1  [LED-3528]  107,83 270 top
LED6  150060VS75000  [CHIPLED_0603]  112,79 180 top
LED8  150060VS75000  [CHIPLED_0603]  116,79 180 top
Q3  AO3419  [SOT23-3]  28,91 180 top
R1  10k  [.0402-B]  90.3,82.6 0 top
R2  1M  [.0402-B]  84.5,77.25 90 top
R3  499k  [.0402-B]  85.7,77.25 270 top
R4  12k  [.0402-B]  80.5,79 0 top
R5  47k  [.0402-B]  34.45,83.7 270 top
R6  4.7k  [.0402-B]  64.1,17.35 180 top
R7  4.7k  [.0402-B]  64.1,16.15 180 top
R8  47k  [.0402-B]  22,71.5 270 top
R9  47k  [.0402-B]  18.1,71.5 270 top
R10  47k  [.0402-B]  16.8,71.5 270 top
R11  47k  [.0402-B]  19.4,71.5 270 top
R12  620  [.0402-B]  107,79.25 90 top
R13  510  [.0402-B]  105.8,79.25 90 top
R14  510  [.0402-B]  108.2,79.25 90 top
R15  10k  [.0402-B]  46.8,86.55 270 top
R16  10k  [.0402-B]  63,50 180 top
R17  0  [.0402-B]  59.2,30.7 135 top
R18  100k  [.0402-B]  55.6,32.7 135 top
R19  1k  [.0402-B]  51.95,25.95 90 top
R20  10k  [.0402-B]  31.4,77.6 180 top
R21  1M  [.0402-B]  102.2,36.1 90 top
R22  1k  [.0402-B]  120,76.1 270 top
R23  1k  [.0402-B]  124,76.1 270 top
R24  1k  [.0402-B]  128,76.1 270 top
R25  1k  [.0402-B]  132,76.1 270 top
R26  0  [.0402-B]  93.35,76.35 90 top
R27  1k  [.0402-B]  116,76.1 270 top
R28  27.4k  [.0402-B]  87.5,77.9 0 top
R29  120  [.0402-B]  20.3,23 270 top
R30  0  [.0402-B]  20.3,20.6 90 top
R31  7.5k  [.0402-B]  119.7,28.1 0 top
R32  7.5k  [.0402-B]  121.6,28.1 0 top
R33  7.5k  [.0402-B]  119.7,23.3 0 top
R34  7.5k  [.0402-B]  121.6,24.5 0 top
R35  7.5k  [.0402-B]  133.6,23.3 180 top
R36  7.5k  [.0402-B]  131.7,24.5 180 top
R37  10k  [.0402-B]  134.35,85.15 270 top
R38  10k  [.0402-B]  80.5,80.2 180 top
R39  7.5k  [.0402-B]  102.7,28.1 0 top
R40  7.5k  [.0402-B]  104.6,28.1 0 top
R41  7.5k  [.0402-B]  102.6,23.3 0 top
R42  7.5k  [.0402-B]  104.6,24.5 0 top
R43  7.5k  [.0402-B]  116.5,24.5 180 top
R44  7.5k  [.0402-B]  114.6,24.5 180 top
R45  7.5k  [.0402-B]  116.25,28.9 90 top
R46  7.5k  [.0402-B]  114.6,28.1 180 top
R47  7.5k  [.0402-B]  133.3,41.1 270 top
R48  7.5k  [.0402-B]  131.7,39.3 180 top
R49  7.5k  [.0402-B]  133.6,34.5 180 top
R50  7.5k  [.0402-B]  131.7,35.7 180 top
R51  7.5k  [.0402-B]  119.7,34.5 0 top
R52  7.5k  [.0402-B]  121.6,35.7 0 top
R53  7.5k  [.0402-B]  119.7,39.3 0 top
R54  7.5k  [.0402-B]  121.6,39.3 0 top
R55  7.5k  [.0402-B]  102.7,39.3 0 top
R56  7.5k  [.0402-B]  104.6,39.3 0 top
R57  7.5k  [.0402-B]  102.7,34.5 0 top
R58  7.5k  [.0402-B]  104.6,35.7 0 top
R59  7.5k  [.0402-B]  116.5,34.5 180 top
R60  7.5k  [.0402-B]  114.6,35.7 180 top
R61  7.5k  [.0402-B]  116.2,41.1 270 top
R62  7.5k  [.0402-B]  114.6,39.3 180 top
R63  10k  [.0402-B]  33.45,77.35 90 top
R64  10k  [.0402-B]  59,54 225 top
R65  100k  [.0402-B]  32.65,91.05 270 top
R66  0  [.0402-B]  68.2,34.5 0 top
R67  47k  [.0402-B]  33.95,85.25 0 top
R68  DNP  [.0402-B]  92.15,76.35 270 top
R69  20k  [.0402-B]  80.9,77.25 270 top
R70  0  [.0402-B]  97.4,78.85 90 top
R71  1k  [.0402-B]  114.1,72.6 270 top
R72  10k  [.0402-B]  75.35,50.7 180 top
R73  562k  [.0402-B]  73,56.45 0 top
R74  100k  [.0402-B]  75,56.45 0 top
R75  10k  [.0402-B]  77.2,48.65 0 top
R76  10k  [.0402-B]  28.9,77.4 180 top
R77  10k  [.0402-B]  22.3,26.55 180 top
R78  47k  [.0402-B]  15.5,71.5 270 top
R79  0  [.0402-B]  131.7,33.3 0 top
R80  0  [.0402-B]  121.6,22.1 180 top
R81  0  [.0402-B]  121.6,33.3 180 top
R82  0  [.0402-B]  114.6,33.3 0 top
R83  0  [.0402-B]  114.6,22.1 0 top
R84  0  [.0402-B]  93.6,30.45 0 top
R85  0  [.0402-B]  104.6,30.5 180 top
R86  0  [.0402-B]  104.6,41.7 180 top
R87  0  [.0402-B]  131.7,41.7 0 top
R88  0  [.0402-B]  131.7,22.1 0 top
R89  0  [.0402-B]  121.6,30.5 180 top
R90  0  [.0402-B]  121.6,41.7 180 top
R91  0  [.0402-B]  114.6,41.7 0 top
R92  0  [.0402-B]  114.6,30.5 0 top
R93  0  [.0402-B]  104.6,22.1 180 top
R94  0  [.0402-B]  104.6,33.3 180 top
R95  DNP  [.0402-B]  87.2,32 90 top
R96  1M  [.0402-B]  83.3,77.25 270 top
R104  0  [.0603-B]  41.5,87.3 135 top
R105  1k  [.0402-B]  31.8,74.25 90 top
R108  100k  [.0402-B]  25.4,90.7 90 top
R109  10k  [.0402-B]  132.8,28.2 0 top
R110  0  [.0402-B]  131.8,29.4 180 top
R111  1k  [.0402-B]  63,47.6 0 top
R201  8.06k  [.0402-B]  33.5,88.2 90 top
R202  4.7k  [.0402-B]  59,26.3 0 top
R203  4.7k  [.0402-B]  59,27.5 0 top
R204  1M  [.0402-B]  48.4,92.2 270 top
SB1  TRACE_BRIDGE_6MIL  [TRACE_BRIDGE_6MIL]  42.05,79 180 top
SB2  TRACE_BRIDGE_6MIL  [TRACE_BRIDGE_6MIL]  44,81.75 270 top
SB3  TRACE_BRIDGE_6MIL  [TRACE_BRIDGE_6MIL]  44,83.25 270 top
SG1  SPARKGAP_RECT_0.15MM  [SPARKGAP_0.15MM]  70,85.8 180 top
SG2  SPARKGAP_RECT_0.15MM  [SPARKGAP_0.15MM]  46.8,89.2 180 top
SG3  [SPARKGAP_5MIL]  46.75,92.25 0 top
SG4  SPARKGAP_RECT_0.15MM  [SPARKGAP_0.15MM]  94,87.4 270 top
SG5  SPARKGAP_RECT_0.15MM  [SPARKGAP_0.15MM]  60.15,85.6 90 top
SW3  FSM1LPSTR  [SWITCH_TAC_NO_GNDED]  141,71 180 top
SW4  FSM1LPSTR  [SWITCH_TAC_NO_GNDED]  141,80 0 top
TCXO1  TCXO_D32G-026.0M  [CRYSTAL-3.2X2.5(4_TERMINAL)]  61.9,31.2 135 top
TP1  [PAD-ROUND-1.0-NOCREAM+SILK]  92.55,82.55 0 top
TP2  PAD+VIA_0.6MM  [PAD+VIA_0.6MM]  59.55,70.3 0 top
TP3  PAD+VIA_0.6MM  [PAD+VIA_0.6MM]  74,68 0 top
TP4  PAD+VIA_0.6MM  [PAD+VIA_0.6MM]  88,84 0 top
TP5  [PAD-ROUND-1.0-NOCREAM+SILK]  98,85 0 top
TP6  [PAD-ROUND-1.0-NOCREAM+SILK]  98,87 0 bottom
TP7  PAD+VIA_GND_0.6MM  [PAD+GND_VIA_0.6MM]  100.5,75.75 0 top
TP8  PAD+VIA_GND_0.6MM  [PAD+GND_VIA_0.6MM]  94.25,63.25 0 top
TP11  [PAD-ROUND-1.0-NOCREAM+SILK]  54.7,83.4 0 bottom
TP12  [PAD-ROUND-1.0-NOCREAM+SILK]  50.4,83.2 0 top
TP13  PAD+VIA_0.6MM  [PAD+VIA_0.6MM]  47.8,25.6 0 top
TP14  [PAD-ROUND-0.7-NOCREAM+SILK]  64.6,35.9 0 bottom
TP15  [PAD-ROUND-0.7-NOCREAM+SILK]  20.1,89.35 0 bottom
TP16  [PAD-ROUND-1.0-NOCREAM+SILK]  68.05,82.2 0 bottom
TP17  [PAD-ROUND-1.0-NOCREAM+SILK]  57.75,72.45 0 bottom
TP18  PAD+VIA_0.6MM  [PAD+VIA_0.6MM]  99.4,33.35 0 top
TP19  [PAD-ROUND-0.7-NOCREAM+SILK]  50.4,83.2 0 bottom
TP20  [PAD-ROUND-0.7-NOCREAM+SILK]  37.9,83.15 0 bottom
TP21  [PAD-ROUND-0.7-NOCREAM+SILK]  33.8,87.65 0 bottom
TP22  [PAD-ROUND-0.7-NOCREAM+SILK]  28.7,54.9 0 bottom
TP23  [PAD-ROUND-0.7-NOCREAM+SILK]  29.8,55.8 0 bottom
TP24  [PAD-ROUND-0.7-NOCREAM+SILK]  63.2,46.8 0 bottom
TP25  [PAD-ROUND-0.7-NOCREAM+SILK]  40.1,30.3 0 bottom
TP26  [PAD-ROUND-0.7-NOCREAM+SILK]  40.35,33.2 0 bottom
TP27  [PAD-ROUND-0.7-NOCREAM+SILK]  31.35,77.85 0 bottom
TP28  [PAD-ROUND-0.7-NOCREAM+SILK]  21.3,81.3 0 bottom
TP29  PAD+VIA_0.25MM  [PAD+VIA_0.25MM]  86.5,72.65 0 top
TP30  [PAD-ROUND-0.7-NOCREAM+SILK]  60.2,34.15 0 bottom
TP34  PAD+VIA_0.6MM  [PAD+VIA_0.6MM]  70.55,43.8 0 top
TP37  [PAD-ROUND-0.7-NOCREAM+SILK]  49.25,31.45 0 bottom
TP38  [PAD-ROUND-0.7-NOCREAM+SILK]  49.3,29.1 0 bottom
TP39  PAD+VIA_0.6MM  [PAD+VIA_0.6MM]  67.55,51.6 0 bottom
TP41  PAD+VIA_0.6MM  [PAD+VIA_0.6MM]  100.75,34.65 0 top
TP44  PAD+VIA_GND_0.6MM  [PAD+GND_VIA_0.6MM]  100.75,33.3 0 top
TP46  [PAD-ROUND-0.7-NOCREAM+SILK]  39.8,15.75 0 bottom
TP47  [PAD-ROUND-0.7-NOCREAM+SILK]  39.4,7.1 0 bottom
TP49  PAD+VIA_0.6MM  [PAD+VIA_0.6MM]  92.1,28.3 0 bottom
TP51  PAD+VIA_0.6MM  [PAD+VIA_0.6MM]  87.2,33.65 0 top
TP52  PAD+VIA_0.6MM  [PAD+VIA_0.6MM]  76.5,17.6 90 top
TP53  PAD+VIA_0.6MM  [PAD+VIA_0.6MM]  81.6,15.65 90 top
TP54  PAD+VIA_GND_0.6MM  [PAD+GND_VIA_0.6MM]  106,89 0 top
TP55  PAD+VIA_GND_0.6MM  [PAD+GND_VIA_0.6MM]  31.8,26.25 0 top
TP56  PAD+VIA_GND_0.6MM  [PAD+GND_VIA_0.6MM]  10.7,80.3 0 top
TP57  PAD+VIA_GND_0.6MM  [PAD+GND_VIA_0.6MM]  62,56 0 top
TP58  PAD+VIA_GND_0.6MM  [PAD+GND_VIA_0.6MM]  21,43.45 0 top
TP59  PAD+VIA_GND_0.6MM  [PAD+GND_VIA_0.6MM]  18.55,15.4 180 top
TP60  PAD+VIA_GND_0.25MM  [PAD+GND_VIA_0.25MM]  70.1,47 0 top
TP62  PAD+VIA_GND_0.6MM  [PAD+GND_VIA_0.6MM]  85.25,31.6 0 top
TP68  PAD+VIA_GND_0.25MM  [PAD+GND_VIA_0.25MM]  60,65.15 0 top
TP69  PAD+VIA_GND_0.25MM  [PAD+GND_VIA_0.25MM]  97.2,63.2 0 top
TP72  [PAD-ROUND-0.7-NOCREAM+SILK]  22,25.4 0 bottom
TP74  PAD+VIA_GND_0.6MM  [PAD+GND_VIA_0.6MM]  86.15,55.65 0 top
TP75  PAD+VIA_GND_0.25MM  [PAD+GND_VIA_0.25MM]  63.5,35.05 0 top
TP77  [PAD-ROUND-0.7-NOCREAM+SILK]  129.25,34.35 0 bottom
TP79  [PAD-ROUND-0.7-NOCREAM+SILK]  122.75,20.35 0 bottom
TP81  [PAD-ROUND-0.7-NOCREAM+SILK]  124.05,34.35 0 bottom
TP82  [PAD-ROUND-0.7-NOCREAM+SILK]  74.75,53.2 0 bottom
TP83  [PAD-ROUND-0.7-NOCREAM+SILK]  112.55,34.4 0 bottom
TP85  [PAD-ROUND-0.7-NOCREAM+SILK]  111,24.15 0 bottom
TP86  [PAD-ROUND-0.7-NOCREAM+SILK]  106,31.4 0 bottom
TP89  [PAD-ROUND-0.7-NOCREAM+SILK]  106,42.9 0 bottom
TP90  [PAD-ROUND-0.7-NOCREAM+SILK]  129.3,42.45 0 bottom
TP93  [PAD-ROUND-0.7-NOCREAM+SILK]  127,23.15 0 bottom
TP94  [PAD-ROUND-0.7-NOCREAM+SILK]  122.55,31.95 0 bottom
TP97  [PAD-ROUND-0.7-NOCREAM+SILK]  124.15,41.7 0 bottom
TP98  [PAD-ROUND-0.7-NOCREAM+SILK]  112.3,42.45 0 bottom
TP101  [PAD-ROUND-0.7-NOCREAM+SILK]  112.1,31.15 0 bottom
TP102  [PAD-ROUND-0.7-NOCREAM+SILK]  109.25,23.3 0 bottom
TP105  [PAD-ROUND-0.7-NOCREAM+SILK]  109.2,34.5 0 bottom
TP106  [PAD-ROUND-0.7-NOCREAM+SILK]  58.8,46.7 0 bottom
TP108  [PAD-ROUND-0.7-NOCREAM+SILK]  43.35,85.75 0 bottom
TP109  [PAD-ROUND-0.7-NOCREAM+SILK]  37.9,84.75 0 bottom
TP133  PAD+VIA_0.6MM  [PAD+VIA_0.6MM]  99.45,70 0 bottom
TP138  PAD+VIA_0.6MM  [PAD+VIA_0.6MM]  33.55,82.25 0 bottom
TP140  PAD+VIA_0.6MM  [PAD+VIA_0.6MM]  78.85,48.65 0 bottom
TP141  PAD+VIA_0.6MM  [PAD+VIA_0.6MM]  28.4,76.05 0 top
TP200  PAD+VIA_0.6MM  [PAD+VIA_0.6MM]  77,55.05 0 bottom
TP300  PAD+VIA_0.25MM  [PAD+VIA_0.25MM]  57.4,52.7 0 top
TP301  PAD+VIA_0.25MM  [PAD+VIA_0.25MM]  32.5,86.3 0 top
U1  SWITCH_74HC4066D  [SO14]  81.6,20.2 0 top
U2  S-1011N42-M6T1U4  [SOT23-6]  89.45,80.4 90 top
U3  ADP160AUJZ-3.0-R7  [SOT23-5]  90.1,31.2 0 top
U4  DAC124S085CIMM  [10-TFSOP]  94.9,24.3 0 top
U5  MAX3051ESAESA+  [SO8]  25,23 90 top
U6  LTC3114IFE-1  [16-LEAD-PLASTIC-TSSOP-FE]  82,73 90 top
U7  LMV344  [SOIC-14]  126.6,25.7 270 top
U8  LMV344  [SOIC-14]  109.6,25.7 270 top
U9  LMV344  [SOIC-14]  126.6,36.9 270 top
U10  LMV344  [SOIC-14]  109.6,36.9 270 top
U11  STM32F427-STM32F427  [LQFP176]  44,45 135 top
U12  MCP73855  [10-LEAD-DFN]  94.95,79.95 0 top
U14  USB3320  [QFN32-5X5]  40.3,82.5 90 top
U15  SWITCH_74HC4066D  [SO14]  70.1,20.2 0 top
U17  LM3671  [SOT23-5L]  74.85,53 90 top
U40  ADP160AUJZ-3.0-R7  [SOT23-5]  76.4,46.1 270 top
U41  ADP160_1.8V  [SOT23-5]  30.1,80.1 90 top
U140  LM317  [SOIC-8]  110.1,72.55 180 top
U$1  [OSHW1]  98.65,49.05 0 top
X1  ABSO7  [2-SMD_ABM7]  54.1,28.2 45 top
XTAL1  DNP  [CRYSTAL-3.2X2.5(4_TERMINAL)]  58.5,34.6 135 top

## Tracks (layer width: path | path; a pad name or v marks a point on that pad's centre or on a via)
!ULPI_RST_B  (via drill 0.25)
  Top 0.15: U11.162 37.73,33.33 38.75,34.35 38.75,35.1 v38.65,35.2 | v37.9,63.45 v33,63.45 | U14.27 37.35,83.25 37.1,83.5 v36.65,83.5 | v33.45,76.1 R63.1
  Bottom 0.15: v38.65,35.2 38.5,35.35 38.5,43.55 38.65,43.7 38.65,45.05 37.8,45.9 37.8,47.55 37.7,47.65 37.7,48.5 37.85,48.65 37.85,63.4 v37.9,63.45 | v33,63.45 32.9,63.55 32.9,75.6 v33.45,76.1 35,76.1 36.4,77.5 36.4,78.9 36.7,79.2 36.7,80.4 36.5,80.6 36.5,83.35 v36.65,83.5 37,83.15 TP20.PAD
ADC1/2/3_CH2_OUT  (via drill 0.25)
  Top 0.15: v108.3,23.15 U8.6
  Top 0.25: U8.7 U8.6
  Top 0.35: U8.6 106.4,23.2 105.3,23.2 C59.1 R93.1
  Bottom 0.15: TP102.PAD 108.45,23.3 v108.3,23.15
ADC1/2/3_CH11_OUT  (via drill 0.25)
  Top 0.15: 112.36,23.3 111.75,23.3 111.6,23.15 v111,23.15
  Top 0.25: R83.1 C61.1 112.36,23.3 U8.9 U8.8
  Bottom 0.15: v111,23.15 TP85.PAD
ADC1/2/3_CH13_OUT  (via drill 0.25)
  Top 0.15: R85.1 v105.1,31.4
  Top 0.25: U8.2 U8.1 106.41,29.51 106.3,29.4 105.2,29.4 C57.1 R85.1
  Bottom 0.15: v105.1,31.4 TP86.PAD
ADC1/2/3_IN2+
  Top 0.25: U8.5 106.37,24.43 106.2,24.6 105.2,24.6 R42.2 C60.1
ADC1/2/3_IN2_FILT
  Top 0.25: R42.1 C59.2
  Top 0.35: C59.2 R41.2
ADC1/2/3_IN11+
  Top 0.25: C62.1 R44.2 112.9,24.5 112.83,24.43 U8.10
ADC1/2/3_IN11_FILT
  Top 0.25: C61.2 R44.1
  Top 0.3: R43.2 R44.1
ADC1/2/3_IN13+
  Top 0.25: U8.3 106.37,26.97 106.2,26.8 105.2,26.8 C58.1 R40.2
ADC1/2/3_IN13_FILT
  Top 0.25: C57.2 R40.1 R39.2
ADC1/2_CH6_OUT  (via drill 0.25)
  Top 0.15: v125.1,34.35 U9.6
  Top 0.25: U9.7 U9.6 122.24,34.36 C69.1 R81.1
  Bottom 0.15: TP81.PAD v125.1,34.35
ADC1/2_CH7_OUT  (via drill 0.25)
  Top 0.15: R90.1 v122.8,41.7
  Top 0.25: U9.2 U9.1 123.41,40.71 123.3,40.6 122.2,40.6 C71.1 R90.1
  Bottom 0.15: v122.8,41.7 TP97.PAD
ADC1/2_CH14_OUT  (via drill 0.25)
  Top 0.15: U9.9 v128.06,34.36 v128.05,34.35
  Top 0.25: U9.8 U9.9 129.76,34.36 129.9,34.5 C67.1 R79.1
  Bottom 0.15: v128.05,34.35 TP77.PAD
ADC1/2_CH15_OUT  (via drill 0.25)
  Top 0.15: U9.14 v129.3,41.45
  Top 0.25: U9.13 U9.14 129.79,40.71 129.9,40.6 131.1,40.6 C65.1 R87.1
  Bottom 0.15: v129.3,41.45 TP90.PAD
ADC1/2_IN6+
  Top 0.25: C70.1 R52.2 123.4,35.7 123.47,35.63 U9.5
ADC1/2_IN6_FILT
  Top 0.25: R52.1 C69.2 R51.2
ADC1/2_IN7+
  Top 0.25: U9.3 122.17,38.17 C72.1 R54.2
ADC1/2_IN7_FILT
  Top 0.25: C71.2 R54.1 R53.2
ADC1/2_IN14+
  Top 0.25: U9.10 131.13,35.63 R50.2 C68.1
ADC1/2_IN14_FILT
  Top 0.25: R50.1 C67.2 R49.2
ADC1/2_IN15+
  Top 0.25: U9.12 131.13,38.17 C66.1 R48.2
ADC1/2_IN15_FILT
  Top 0.25: R48.1 C65.2 132.3,40.6 R47.2
ADC2_CH2  (via drill 0.25)
  Top 0.15: D1.5 101.2,6.82
  Top 0.2: R41.1 102.1,24 101.75,24.35 v101.45,24.35
  Top 0.25: 101.2,6.82 J9.16
  Bottom 0.2: J9.16 102.65,8.35 101.25,9.8 101.25,17.95 101.55,18.25 101.55,20.65 102.1,21.2 102.1,24 101.75,24.35 v101.45,24.35
ADC2_CH2_FLT  (via drill 0.25)
  Top 0.15: U11.42 60.75,42.05 61.35,42.05 v61.8,42.5 | v63.75,28.8 65,28.8 68,31.8 71,31.8 76.75,37.55 84.55,37.55 84.95,37.15 87.9,37.15 v88.1,37.35
  Top 0.2: v90.15,19.45 90.15,19 91.55,17.6 98.55,17.6 102.25,21.3 102.65,21.3 103.1,21.75 C135.1
  Top 0.35: R93.2 C135.1
  Bottom 0.15: v61.8,42.5 61.8,30.7 v63.75,28.8 | v88.1,37.35 90.15,35.3 v90.15,19.45
ADC2_CH6  (via drill 0.25)
  Top 0.15: 102.4,3.75 103.85,5.2 103.85,6.93
  Top 0.2: v105.35,19.25 107.5,19.25 107.75,19 108.65,19 109,19.35 110.3,19.35 110.4,19.25 v119.95,19.25 | v119.2,35.5 R51.1
  Top 0.25: D1.2 102.4,3.75 | 103.85,6.93 J9.18
  Bottom 0.2: v119.95,19.25 119.3,19.9 119.3,35.4 v119.2,35.5 | J9.18 105.19,19.09 v105.35,19.25
ADC2_CH6_FLT  (via drill 0.25)
  Top 0.15: U11.52 57.45,48.2 55.65,48.2 v55.5,48.35 | v56.25,24.15 57.85,24.15 58.35,23.65 59.6,23.65 61.25,25.3 61.25,26.05 62.9,27.7 65.3,27.7 68.5,30.9 71.6,30.9 77.35,36.65 84.05,36.65 84.5,36.2 85.55,36.2 86,35.75 86.75,35.75 v86.95,35.55 | v86.65,42.75 86.65,42.8 87,43.15 87.75,43.15 88.1,42.8 95.55,42.8 95.65,42.9 95.65,45.25 97.3,46.9 119.15,46.9 v119.35,47.1 | v120.2,32.4 C122.1
  Top 0.25: R81.2 C122.1
  Bottom 0.15: v55.5,48.35 55.2,48.05 55.2,42.85 55.95,42.1 55.95,37.6 55.25,36.9 55.25,36.2 55.5,35.95 55.5,35.45 55.85,35.1 55.85,30.95 56.4,30.4 56.4,24.25 v56.25,24.15 | v86.95,35.55 86.9,42.5 v86.65,42.75 | v119.35,47.1 119.35,38.75 119.65,38.45 119.65,36.55 120.2,36 v120.2,32.4
ADC2_CH7  (via drill 0.25)
  Top 0.2: v108.2,19.7 108.25,19.75 112,19.75 112.15,19.9 v120.35,19.85 | v119.1,38.2 119.1,39.2 R53.1
  Top 0.25: D5.7 109.25,3.9 109,4.15 109,6.95 J9.20
  Bottom 0.2: v108.2,19.7 108.2,9.1 107.95,8.65 107.85,8.55 J9.20 | v120.35,19.85 119.7,20.45 119.7,35.1 119.8,35.2 119.8,35.8 119.5,36.1 119.3,36.1 119.1,36.3 v119.1,38.2
ADC2_CH7_FLT  (via drill 0.25)
  Top 0.15: U11.53 57.74,49.24 57.05,48.55 56.6,48.55 v56.35,48.8 | v58.85,24.15 59.65,24.15 60.95,25.45 60.95,26.2 62.75,28 65.15,28 68.35,31.2 71.4,31.2 77.15,36.95 84.2,36.95 84.65,36.5 85.7,36.5 86.15,36.05 87.35,36.05 87.5,36.2 v87.5,36.65 | v87.5,42.65 87.7,42.5 95.75,42.5 95.95,42.7 95.95,45.1 97.45,46.6 120,46.6 v120.15,46.8 | v120.15,42.65 120.15,41.75 C132.1
  Top 0.25: R90.2 C132.1
  Bottom 0.15: v56.35,48.8 56.35,48.4 55.5,47.6 55.5,45.25 55.55,45.2 55.55,43.75 55.7,43.6 56.8,43.6 57.05,43.35 57.05,42.85 56.85,42.65 56.85,36 57.1,35.75 57.1,31.7 57.6,31.2 57.6,28.15 57.75,28 58.65,28 58.85,27.7 v58.85,24.15 | v87.5,36.65 v87.5,42.65 | v120.15,46.8 v120.15,42.65
ADC2_CH11  (via drill 0.25)
  Top 0.15: 111.1,4.85 111.4,5.15 111.4,7.15 111.3,7.25 111.3,7.24
  Top 0.2: v110.1,18.15 v117.05,18.15 | v117,25.25 R43.1
  Top 0.25: D5.4 110.45,4.2 111.1,4.85 | 111.3,7.24 J9.22
  Bottom 0.2: v117.05,18.15 v117,25.25 | v110.1,18.15 110.1,16.8 111.05,15.85 111.05,9.25 110.7,8.84 J9.22
ADC2_CH11_FLT  (via drill 0.25)
  Top 0.15: U11.33 56.73,39.67 v57.55,38.85 | v62.4,12.5 62.55,12.3 115,12.3 v115.2,12.5 | v115.95,22.95 115.95,22.15 C124.1
  Top 0.25: R83.2 C124.1
  Bottom 0.15: v57.55,38.85 57.55,33.2 58.7,32.05 58.7,29.3 59.35,28.65 59.35,22 62.4,18.95 v62.4,12.5 | 115.7,22.85 115.75,22.9 115.9,22.9 v115.95,22.95
  Bottom 0.2: 115.7,22.85 115.7,18.4 115.2,17.9 115.2,13.85 v115.2,12.5
ADC2_CH13  (via drill 0.25)
  Top 0.15: 111.7,4.75 111.7,7.15 111.85,7.31
  Top 0.2: v102.5,27.1 102.2,27.4 R39.1 | v103,20.35 v109.9,20.35
  Top 0.25: D5.2 111.25,4.25 111.7,4.75 | 111.85,7.31 J9.24
  Bottom 0.2: v103,20.35 103,24.65 102.45,25.2 102.45,27 v102.5,27.1 | v109.9,20.35 110,20.35 111.85,18.5 111.85,12.75 112.8,11.8 112.8,8.38 J9.24
ADC2_CH13_FLT  (via drill 0.25)
  Top 0.15: U11.35 58.1,39.75 58.1,39.35 58.05,39.25 58.05,38.7 58.1,38.6 v58.1,38.05 | v63.15,12.8 63.35,12.6 103.4,12.6 v103.6,12.8 | v103.2,29.3 C125.1
  Top 0.25: C125.1 R85.2
  Bottom 0.15: v58.1,38.05 58.1,37.95 58.3,37.75 58.3,32.95 59,32.25 59,29.45 59.65,28.8 59.65,22.3 62.7,19.25 62.7,13.25 v63.15,12.8 | v103.6,12.8 103.6,28.9 v103.2,29.3
ADC2_CH14  (via drill 0.25)
  Top 0.2: v135.3,34.5 R49.1 | v135.3,20.4 119.1,20.4 118.6,20.9 v112.7,20.9
  Top 0.25: D6.7 118.15,3.8 116.55,5.4 116.55,7.07 J9.26
  Bottom 0.2: v135.3,20.4 135.3,22.8 135.4,22.9 135.4,23.7 135.3,23.8 v135.3,34.5 | v112.7,20.9 112.7,13.2 115.35,10.52 J9.26
ADC2_CH14_FLT  (via drill 0.25)
  Top 0.15: U11.54 57.44,49.63 59.8,52 60.05,52 60.5,52.45 63.6,52.45 63.9,52.15 v64.05,52.15 | v64.55,43.35 65.8,43.35 66.35,42.8 66.35,41.2 67.2,40.35 97.65,40.35 98.15,40.85 98.15,44.05 98.5,44.4 v134,44.4 | v134,32.35 133.45,32.35 133.1,32.7 C84.1
  Top 0.25: C84.1 R79.2
  Bottom 0.15: v64.05,52.15 64.75,51.45 64.75,44.6 64.4,44.25 64.4,43.55 64.5,43.4 v64.55,43.35 | v134,44.4 v134,32.35
ADC2_CH15  (via drill 0.25)
  Top 0.15: 133.4,41.75 133.4,43.6 133.15,43.85 130.55,43.85 130.1,43.4 127.7,43.4 127.5,43.6 125.2,43.6 v125.1,43.5
  Top 0.2: 133.4,41.75 133.3,41.7 R47.1 | v125,17.5 v115.9,17.5
  Top 0.25: D6.4 119.35,4.45 119.15,4.65 119.15,7.01 J9.28
  Bottom 0.15: 117.9,8.9 117.89,8.85 J9.28
  Bottom 0.2: v115.9,17.5 116.1,17.3 116.1,11.9 117.9,10.1 117.9,8.9 | v125.1,43.5 125.1,41.05 126.1,40.05 126.1,34.6 125.55,34.05 125.55,33.05 124.5,32 124.5,24.05 125,23.55 v125,17.5
ADC2_CH15_FLT  (via drill 0.25)
  Top 0.15: U11.55 57.1,49.95 58.35,51.2 58.55,51.35 59.6,52.4 59.9,52.4 60.3,52.8 v64.05,52.8 | v64.9,43.95 65.05,44.1 66,44.1 66.65,43.45 66.65,41.35 67.35,40.65 97.5,40.65 97.85,41 97.85,44.2 98.35,44.7 132.65,44.7 v132.85,44.9 | v132.9,42.9 C129.1
  Top 0.25: R87.2 C129.1
  Bottom 0.15: v64.05,52.8 64.35,52.8 65.05,52.1 65.05,44.1 v64.9,43.95 | v132.85,44.9 132.85,43.05 132.9,43 v132.9,42.9
ADC3_CH4_OUT  (via drill 0.25)
  Top 0.15: v108.3,34.5 108.2,34.5 108.05,34.35 U10.6
  Top 0.25: C75.1 R94.1 | U10.7 U10.6
  Top 0.35: U10.6 106.3,34.4 105.3,34.4 C75.1
  Bottom 0.15: TP105.PAD v108.3,34.5
ADC3_CH5  (via drill 0.25)
  Top 0.15: v118.5,16.2 118.25,16.2 118.05,16 105.1,16 v104.4,16.7
  Top 0.2: v118.4,28.1 R31.1
  Top 0.25: D1.4 101.6,4.68 J9.15
  Bottom 0.2: v118.5,16.2 118.5,23.9 118.1,24.3 118.1,24.9 118.4,25.2 v118.4,28.1 | J9.15 103.95,7.03 103.95,9.5 104.75,10.35 104.75,11.75 104.8,16.3 v104.4,16.7
ADC3_CH5_FLT  (via drill 0.25)
  Top 0.15: U11.25 53.88,36.87 53.88,36.92 53.15,37.65 53.15,37.85 v52.8,38.2 | v86.3,36.65 86.15,36.8 84.8,36.8 84.35,37.25 76.95,37.25 71.2,31.5 68.15,31.5 64.95,28.3 62.6,28.3 60.65,26.35 60.65,25.6 59.7,24.65 53.9,24.65 v53.45,24.2 | v86.35,37.75 86.5,37.85 93.3,37.85 93.65,37.5 v97.2,37.5 | C131.1 120.2,31.5 119.3,32.6 113.45,32.6 113.05,32.2 110.8,32.2 v110.4,32.6 | v108,32.1 v97.2,32.1
  Top 0.25: R89.2 C131.1
  Bottom 0.15: v52.8,38.2 53.15,37.85 53.15,34.2 53.45,33.9 v53.45,24.2 | v86.3,36.65 86.35,36.75 v86.35,37.75 | v110.4,32.6 108.5,32.6 v108,32.1 | v97.2,32.1 v97.2,37.5
ADC3_CH5_OUT  (via drill 0.25)
  Top 0.15: R89.1 v122.9,30.5
  Top 0.25: U7.2 U7.1 | C49.1 R89.1
  Top 0.3: U7.1 122.86,29.51 122.65,29.3 C49.1
  Bottom 0.15: v122.9,30.5 122.9,31.4 TP94.PAD
ADC3_CH6  (via drill 0.25)
  Top 0.15: v107.2,16.8 107.55,16.45 117.9,16.45 118.25,16.8 118.8,16.8 119.15,16.45 v134.7,16.45
  Top 0.2: v134.8,23.3 R35.1
  Top 0.25: D1.1 102.8,3.34 J9.17
  Bottom 0.2: v134.7,16.45 134.7,23.2 v134.8,23.3 | J9.17 106.15,6.69 106.15,6.7 106.4,6.95 106.4,16 v107.2,16.8
ADC3_CH6_FLT  (via drill 0.25, 0.25 pad 0.25)
  Top 0.15: v52.65,39.65 53.3,39 53.3,38.17 U11.26 | v65.7,25.65 65.95,25.9 85.4,25.9 86.3,25 86.3,20.65 92,14.95 129.75,14.95 129.9,15.1 v132.1,15.1 | v65.7,27.3 65.65,27.25 64.1,27.25 59.35,22.5 55.7,22.5 v55.1,22.7
  Top 0.2: C130.1 R88.2 v132.2,21
  Bottom 0.15: v52.65,39.65 53.3,39 53.3,38.25 53.5,38.05 53.5,34.35 53.75,34.1 53.75,25.6 55.1,24.25 v55.1,22.7 | v65.7,27.3 v65.7,25.65 | v132.1,15.1 132.1,20.9 v132.2,21
ADC3_CH6_OUT  (via drill 0.25)
  Top 0.15: U7.9 v128.01,23.16 v128,23.15
  Top 0.25: U7.8 U7.9 | R88.1 C53.1
  Top 0.3: U7.9 130.46,23.16 130.6,23.3 C53.1
  Bottom 0.15: v128,23.15 TP93.PAD
ADC3_CH7  (via drill 0.25)
  Top 0.2: v109.35,18.7 v119.3,18.7 | v118.75,24.55 119.2,24.1 R33.1
  Top 0.25: D5.8 108.85,3.56 107.71,4.7 107.7,4.7 107.7,5.7 J9.19
  Bottom 0.2: v119.3,18.7 118.9,19.1 118.9,24.4 v118.75,24.55 | J9.19 109,7 109,9.3 110.65,10.95 110.65,15.45 109.6,16.5 109.6,17.6 109.35,17.85 v109.35,18.7
ADC3_CH7_FLT  (via drill 0.25)
  Top 0.15: v53.65,39.45 53.65,38.53 U11.27 | v121.1,21.05 R80.2 | v121.2,12.75 120.2,11.7 55.8,11.7 v55.6,11.9
  Top 0.25: R80.2 C95.1
  Bottom 0.15: v53.65,39.45 53.65,38.6 53.9,38.35 53.9,34.5 54.05,34.35 54.05,25.8 55.6,24.25 v55.6,11.9 | v121.2,12.75 121.2,20.85 v121.1,21.05
ADC3_CH7_OUT  (via drill 0.25)
  Top 0.15: v122.1,21.1 R80.1
  Top 0.25: U7.7 U7.6 | C51.1 R80.1
  Top 0.3: U7.6 122.84,23.16 122.7,23.3 C51.1
  Bottom 0.15: TP79.PAD 122.7,20.5 v122.1,21.1
ADC3_CH8  (via drill 0.25)
  Top 0.2: R45.1 v116.25,27.6 | v114.45,17.05 v111.1,17.05
  Top 0.25: D5.5 110.05,5.51 J9.21
  Bottom 0.2: J9.21 111.5,6.96 111.55,8.75 111.55,12.45 111.45,12.55 111.45,16.7 v111.1,17.05 | v116.25,27.6 115.25,26.55 115.25,18.7 114.45,17.9 v114.45,17.05
ADC3_CH8_FLT  (via drill 0.25)
  Top 0.15: U11.28 55.85,37.05 55.85,36.75 v55.75,36.65 | v120.2,29.35 117.85,29.35 117.45,29.75 117.45,31.75 117.15,32.25 116.05,32.25 115.7,31.9 C134.1 | v120.4,12.75 119.65,12 56.4,12 v56.2,12.2
  Top 0.25: R92.2 C134.1
  Bottom 0.15: v55.75,36.65 55.8,36.6 55.8,35.6 56.2,35.2 56.2,31.1 56.7,30.6 56.7,25.15 56.75,25.1 56.75,23.7 55.9,22.85 55.9,12.5 v56.2,12.2 | v120.4,12.75 120.75,13.15 120.9,13.3 120.9,20.4 120.55,20.85 120.55,29 v120.2,29.35
ADC3_CH8_OUT  (via drill 0.25)
  Top 0.15: U8.14 v112.3,30.2
  Top 0.25: U8.13 U8.14 112.79,29.51 112.9,29.4 114,29.4 C63.1 R92.1
  Bottom 0.15: v112.3,30.2 112.3,31.05 112.25,31.1 112.25,31.15 TP101.PAD
ADC3_CH9  (via drill 0.25)
  Top 0.2: v111.2,20.35 v117.55,20.35 | v117.1,41.6 R61.1
  Top 0.25: D5.1 111.65,4.02 112.8,5.17 112.8,5.4 J9.23
  Bottom 0.2: v111.2,20.35 112.3,19.25 112.3,12.9 114,11.2 114,6.97 J9.23 | v117.55,20.35 117.4,20.7 117.4,24.7 117.6,24.9 117.6,41.1 v117.1,41.6
ADC3_CH9_FLT  (via drill 0.25)
  Top 0.15: U11.19 51.78,34.72 52.5,34 v52.5,33.4 | v53.45,11.6 53.7,11.4 120.75,11.4 v121.35,12 | v121.6,42.75 120.8,42.75 120.35,43.2 115.95,43.2 115.65,42.9 C133.1
  Top 0.25: R91.2 C133.1
  Bottom 0.15: v52.5,33.4 52.85,33.05 52.85,25.7 52.65,25.5 52.65,23.65 53.45,22.9 54,22.4 54,19.25 53.5,18.75 v53.45,11.6 | v121.6,42.75 121.6,13.3 121.8,13.05 121.8,12.45 v121.35,12
ADC3_CH14  (via drill 0.25)
  Top 0.2: v102.2,38.3 R55.1 | v102,17.6 110.55,17.6 110.6,17.65 111.55,17.65 111.6,17.6 v113.4,17.6
  Top 0.25: D6.8 117.75,3.33 J9.25
  Bottom 0.2: v102,17.6 102,20.35 102.55,20.9 102.55,24.4 101.95,25 102,38 v102.2,38.3 | J9.25 116.65,7.03 116.65,9.9 113.4,13.15 v113.4,17.6
ADC3_CH14_FLT  (via drill 0.25)
  Top 0.15: U11.20 52.1,35.1 51.25,35.95 51.25,37.95 v51.35,38.1 | v51.55,47.35 53.8,47.35 54,47.55 56.9,47.55 v57.05,47.4 | v59.1,50.55 59.1,50.8 59.95,51.65 60.2,51.65 60.65,52.1 63.1,52.1 v63.25,51.95 | v64.1,42.05 65.45,42.05 65.65,41.85 65.65,40.85 66.85,39.65 98.1,39.65 99.25,40.8 103.05,40.8 103.2,40.95 C128.1
  Top 0.25: R86.2 C128.1
  Bottom 0.15: v51.35,38.1 51.35,47.2 v51.55,47.35 | v57.05,47.4 57.15,47.55 57.6,48 57.6,49.05 v59.1,50.55 | v63.25,51.95 64.45,50.75 64.45,44.8 64.1,44.45 64.1,43.75 64.05,43.7 64.05,42.95 64.1,42.9 v64.1,42.05
ADC3_CH14_OUT  (via drill 0.25)
  Top 0.15: R86.1 105.85,41.7 v106,41.85
  Top 0.25: R86.1 C73.1
  Top 0.35: U10.2 U10.1 106.3,40.6 105.3,40.6 C73.1
  Bottom 0.15: v106,41.85 TP89.PAD
ADC3_CH15  (via drill 0.25)
  Top 0.2: v117,35.6 R59.1
  Top 0.25: D6.5 118.95,4.05 117.9,5.1 J9.27
  Bottom 0.2: v117,35.6 117.2,35.4 117.2,26.35 116.5,25.75 116.5,12.11 116.69,11.9 117.05,11.54 117.35,11.25 119.15,9.45 119.15,6.99 J9.27
ADC3_CH15_FLT  (via drill 0.25)
  Top 0.15: v52.1,36.8 51.9,36.6 51.9,36.04 U11.21 | v52.95,22.65 53.4,22.2 59.5,22.2 64.15,26.85 65.4,26.85 65.45,26.8 85.85,26.8 87.55,25.1 87.55,21.05 91.35,17.25 98.85,17.25 102.5,20.9
  Top 0.2: v111.85,20.9 102.5,20.9
  Top 0.25: R82.2 v115.9,33.3 C123.1
  Bottom 0.15: v52.1,36.8 52,36.7 52,33.15 52.55,32.6 52.55,26.05 52.35,25.8 52.35,23.25 v52.95,22.65
  Bottom 0.2: v115.9,33.3 112.95,30.35 112.95,29.45 111.85,28.35 v111.85,20.9
ADC3_CH15_OUT  (via drill 0.25)
  Top 0.15: U10.9 111.16,34.36 v111.1,34.35
  Top 0.25: U10.8 U10.9 112.76,34.36 112.9,34.5 C77.1 R82.1
  Bottom 0.15: v111.1,34.35 112.6,34.35 TP83.PAD
ADC3_IN4+
  Top 0.25: R58.2 C76.1
  Top 0.35: U10.5 106.3,35.7 R58.2
ADC3_IN4_FILT
  Top 0.25: R57.2 C75.2 R58.1
ADC3_IN5+
  Top 0.25: U7.3 122.17,26.97 C50.1 R32.2
ADC3_IN5_FILT
  Top 0.25: C49.2 R32.1 R31.2
ADC3_IN6+
  Top 0.25: R36.2 C54.1
  Top 0.3: U7.10 131.13,24.43 R36.2
ADC3_IN6_FILT
  Top 0.25: R36.1 C53.2 R35.2
ADC3_IN7+
  Top 0.25: U7.5 123.67,24.43 123.6,24.5 R34.2 C52.1
ADC3_IN7_FILT
  Top 0.25: R33.2 C51.2 R34.1
ADC3_IN8+
  Top 0.25: R46.2 C64.1 112.9,26.9 112.83,26.97 U8.12
ADC3_IN8_FILT
  Top 0.25: R45.2 115.3,29.4 115.2,29.3 C63.2 R46.1
ADC3_IN9+
  Top 0.25: U10.12 114.03,38.17 C80.1 R62.2
ADC3_IN9_FILT
  Top 0.25: R62.1 C79.2 115.2,40.5 115.3,40.6 R61.2
ADC3_IN9_OUT  (via drill 0.25)
  Top 0.15: U10.14 v112.3,41.5
  Top 0.25: R91.1 C79.1 113.89,40.61 112.61,40.61 112.6,40.6 U10.14
  Top 0.35: U10.13 U10.14
  Bottom 0.15: v112.3,41.5 TP98.PAD
ADC3_IN14+
  Top 0.25: C74.1 R56.2
  Top 0.35: U10.3 106.4,38.1 C74.1
ADC3_IN14_FILT
  Top 0.25: C73.2 R56.1 R55.2
ADC3_IN15+
  Top 0.25: U10.10 114.03,35.63 R60.2 C78.1
ADC3_IN15_FILT
  Top 0.25: R60.1 C77.2 R59.2
BOOT0  (via drill 0.25)
  Top 0.15: U11.166 39.07,31.92 39.83,32.67 | 39.83,32.67 40.3,33.15 v42.2,33.1 | v41.85,25.5 46.4,25.5 47.3,24.6 52.75,24.6 53.1,24.95 59.55,24.95 60.35,25.75 60.35,26.5 63.15,29.3 65.05,29.3 67.85,32.1 70.85,32.1 76.6,37.85 84.95,37.85 v85.1,37.75 | v85.1,42.75 85.95,42.75 86.65,43.45 87.9,43.45 88.25,43.1 95.25,43.1 95.35,43.2 95.35,45.4 97.15,47.2 118.7,47.2 119.1,47.6 119.6,47.6 119.85,47.3 120.45,47.3 121.1,46.65 126.15,46.65 135.65,56.2 135.65,60.85 | 135.65,60.85 135.65,61.5 v136.2,62.05 | v40.35,32.35 40.15,32.35 39.83,32.67 | 135.65,60.85 129.99,60.85 JP2.4 JP2.3
  Top 0.25: v137.75,80.5 137.03,81.22 SW4.1 | SW4.1 136.35,82.2 134.6,82.2 134.35,82.45 134.35,84.38 134.38,84.65 R37.2 | SW4.2 144.93,82.2 137.15,82.2 137.1,82.25 SW4.1
  Bottom 0.15: v42.2,33.1 42.4,32.7 42.4,26.05 v41.85,25.5 | v85.1,37.75 v85.1,42.75 | TP26.PAD v40.35,32.35
  Bottom 0.25: v136.2,62.05 137.3,62.05 137.75,62.5 v137.75,80.5
BOOT1
  Top 0.2: R64.2 58.2,53.2 57.9,53.2 TP300.TP 57.4,52.39 U11.58
BST1  (via drill 0.25)
  Top 0.35: U6.13 77.83,72.67 v77.8,72.7 | v75.85,69.65 C41.1
  Bottom 0.35: v77.8,72.7 77.8,71.6 v75.85,69.65
BST2  (via drill 0.25)
  Top 0.35: C45.1 v88.2,69.65 | v78.2,73.35 79.2,73.35 U6.12
  Bottom 0.35: v88.2,69.65 80.6,69.65 79.7,70.55 79.7,72.15 78.5,73.35 v78.2,73.35
CAN1-H  (via drill 0.25)
  Top 0.15: v23.95,16.1 24.2,15.85 62.45,15.85 63.3,15 v64.6,15 | v23.95,22.35 22.41,22.35 U5.7
  Top 0.2: U5.7 22.36,22.4 20.6,22.4 20.5,22.5 R29.2
  Top 0.25: D12.4 63.75,3.75 64.8,4.8 64.8,7.05 64.7,7.15 64.5,7.36 J8.38
  Bottom 0.15: v23.95,16.1 v23.95,22.35 | v64.6,15 64.6,10.85 63.6,9.85 J8.38
CAN1-L  (via drill 0.25)
  Top 0.15: v23.15,15.55 62.3,15.55 63.15,14.7 64.1,14.7 64.45,14.35 v65.1,14.35 | v23.95,23.6 22.43,23.6 U5.6
  Top 0.2: U5.6 22.36,23.6 20.5,23.6 20.4,23.5 R29.1
  Top 0.25: D12.5 63.35,5.49 J8.37
  Bottom 0.15: v23.15,15.55 23.2,22.75 23.2,22.85 v23.95,23.6 | v65.1,14.35 64.9,14.15 64.9,10.65 64.85,10.55 64.85,6.99 J8.37
CAN_RS
  Top 0.2: U5.8 R30.2
  Top 0.35: U5.8
CHG-ENABLE
  Top 0.15: 92.55,81.35 U2.3 90.65,81.35 90.55,81.45 90.75,81.45 90.8,81.4 R1.2 | 92.55,81.35 93.95,81.35 U12.10 | TP1.PAD 92.55,81.35
CHRG_IND_CATHODE
  Top 0.15: LED4.C R25.1
CN
  Top 0.15: U2.6 89.3,79.45 89.3,81.85 88,83.15 TP4.TP
CP
  Top 0.15: C103.1 88.1,81.4 U2.4
DAC124_VREFIN
  Top 0.15: U4.7 95.4,27.55 95.55,27.7 95.55,28.25 95.8,28.5 95.8,30.1 95.45,30.45 R84.2
  Top 0.3: U4.7 95.4,24.2 95.8,23.8 97.2,23.8 98,23 98.87,23 JP5.2